# EasyEDA Pro project ProPrj_Syndra Version 2_2026-02-07.epro, schematic Schematic2
Board Name: DisplayBoard; Create Date: 2025-08-30; Page Name: P1; Project Name: Syndra3; Schematic Name: LED Matrix; Update Date: 2025-08-30; Company: torvid.net/syndra; Page Size: -; Version: V1.0
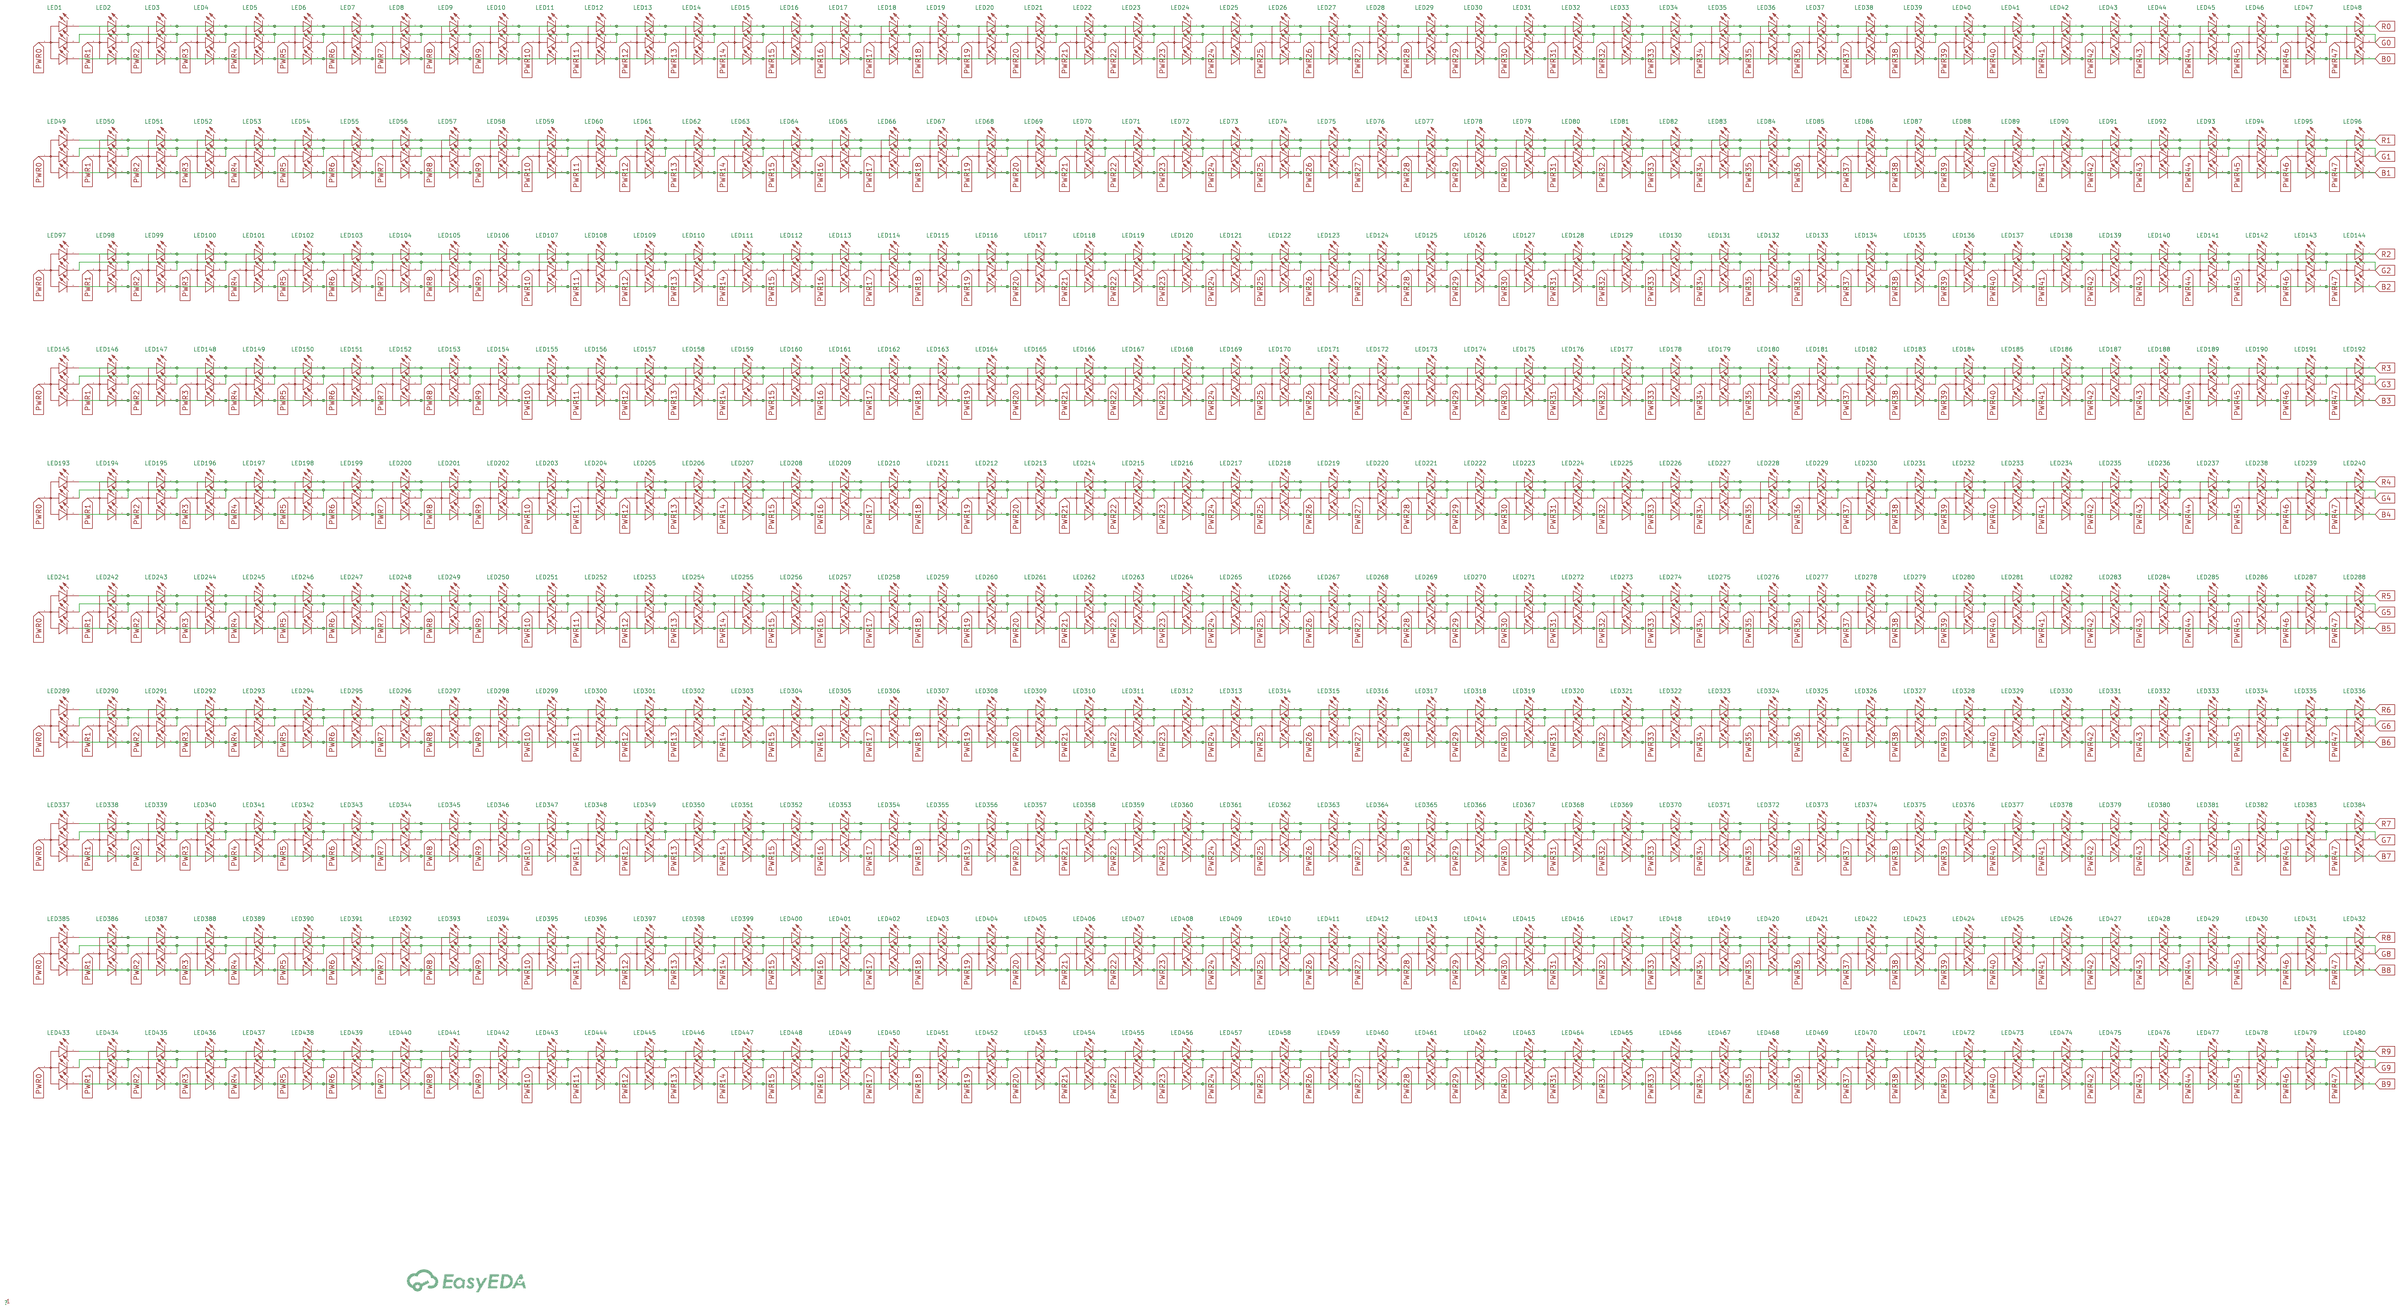
[diagram p0: schematic sheet]

## Parts
LED1  FC-B1010RGBT-HG  [LED-ARRAY-SMD_4P-L1.0-W1.0-TR-RD]
LED2  FC-B1010RGBT-HG  [LED-ARRAY-SMD_4P-L1.0-W1.0-TR-RD]
LED3  FC-B1010RGBT-HG  [LED-ARRAY-SMD_4P-L1.0-W1.0-TR-RD]
LED4  FC-B1010RGBT-HG  [LED-ARRAY-SMD_4P-L1.0-W1.0-TR-RD]
LED5  FC-B1010RGBT-HG  [LED-ARRAY-SMD_4P-L1.0-W1.0-TR-RD]
LED6  FC-B1010RGBT-HG  [LED-ARRAY-SMD_4P-L1.0-W1.0-TR-RD]
LED7  FC-B1010RGBT-HG  [LED-ARRAY-SMD_4P-L1.0-W1.0-TR-RD]
LED8  FC-B1010RGBT-HG  [LED-ARRAY-SMD_4P-L1.0-W1.0-TR-RD]
LED9  FC-B1010RGBT-HG  [LED-ARRAY-SMD_4P-L1.0-W1.0-TR-RD]
LED10  FC-B1010RGBT-HG  [LED-ARRAY-SMD_4P-L1.0-W1.0-TR-RD]
LED11  FC-B1010RGBT-HG  [LED-ARRAY-SMD_4P-L1.0-W1.0-TR-RD]
LED12  FC-B1010RGBT-HG  [LED-ARRAY-SMD_4P-L1.0-W1.0-TR-RD]
LED13  FC-B1010RGBT-HG  [LED-ARRAY-SMD_4P-L1.0-W1.0-TR-RD]
LED14  FC-B1010RGBT-HG  [LED-ARRAY-SMD_4P-L1.0-W1.0-TR-RD]
LED15  FC-B1010RGBT-HG  [LED-ARRAY-SMD_4P-L1.0-W1.0-TR-RD]
LED16  FC-B1010RGBT-HG  [LED-ARRAY-SMD_4P-L1.0-W1.0-TR-RD]
LED17  FC-B1010RGBT-HG  [LED-ARRAY-SMD_4P-L1.0-W1.0-TR-RD]
LED18  FC-B1010RGBT-HG  [LED-ARRAY-SMD_4P-L1.0-W1.0-TR-RD]
LED19  FC-B1010RGBT-HG  [LED-ARRAY-SMD_4P-L1.0-W1.0-TR-RD]
LED20  FC-B1010RGBT-HG  [LED-ARRAY-SMD_4P-L1.0-W1.0-TR-RD]
LED21  FC-B1010RGBT-HG  [LED-ARRAY-SMD_4P-L1.0-W1.0-TR-RD]
LED22  FC-B1010RGBT-HG  [LED-ARRAY-SMD_4P-L1.0-W1.0-TR-RD]
LED23  FC-B1010RGBT-HG  [LED-ARRAY-SMD_4P-L1.0-W1.0-TR-RD]
LED24  FC-B1010RGBT-HG  [LED-ARRAY-SMD_4P-L1.0-W1.0-TR-RD]
LED25  FC-B1010RGBT-HG  [LED-ARRAY-SMD_4P-L1.0-W1.0-TR-RD]
LED26  FC-B1010RGBT-HG  [LED-ARRAY-SMD_4P-L1.0-W1.0-TR-RD]
LED27  FC-B1010RGBT-HG  [LED-ARRAY-SMD_4P-L1.0-W1.0-TR-RD]
LED28  FC-B1010RGBT-HG  [LED-ARRAY-SMD_4P-L1.0-W1.0-TR-RD]
LED29  FC-B1010RGBT-HG  [LED-ARRAY-SMD_4P-L1.0-W1.0-TR-RD]
LED30  FC-B1010RGBT-HG  [LED-ARRAY-SMD_4P-L1.0-W1.0-TR-RD]
LED31  FC-B1010RGBT-HG  [LED-ARRAY-SMD_4P-L1.0-W1.0-TR-RD]
LED32  FC-B1010RGBT-HG  [LED-ARRAY-SMD_4P-L1.0-W1.0-TR-RD]
LED33  FC-B1010RGBT-HG  [LED-ARRAY-SMD_4P-L1.0-W1.0-TR-RD]
LED34  FC-B1010RGBT-HG  [LED-ARRAY-SMD_4P-L1.0-W1.0-TR-RD]
LED35  FC-B1010RGBT-HG  [LED-ARRAY-SMD_4P-L1.0-W1.0-TR-RD]
LED36  FC-B1010RGBT-HG  [LED-ARRAY-SMD_4P-L1.0-W1.0-TR-RD]
LED37  FC-B1010RGBT-HG  [LED-ARRAY-SMD_4P-L1.0-W1.0-TR-RD]
LED38  FC-B1010RGBT-HG  [LED-ARRAY-SMD_4P-L1.0-W1.0-TR-RD]
LED39  FC-B1010RGBT-HG  [LED-ARRAY-SMD_4P-L1.0-W1.0-TR-RD]
LED40  FC-B1010RGBT-HG  [LED-ARRAY-SMD_4P-L1.0-W1.0-TR-RD]
LED41  FC-B1010RGBT-HG  [LED-ARRAY-SMD_4P-L1.0-W1.0-TR-RD]
LED42  FC-B1010RGBT-HG  [LED-ARRAY-SMD_4P-L1.0-W1.0-TR-RD]
LED43  FC-B1010RGBT-HG  [LED-ARRAY-SMD_4P-L1.0-W1.0-TR-RD]
LED44  FC-B1010RGBT-HG  [LED-ARRAY-SMD_4P-L1.0-W1.0-TR-RD]
LED45  FC-B1010RGBT-HG  [LED-ARRAY-SMD_4P-L1.0-W1.0-TR-RD]
LED46  FC-B1010RGBT-HG  [LED-ARRAY-SMD_4P-L1.0-W1.0-TR-RD]
LED47  FC-B1010RGBT-HG  [LED-ARRAY-SMD_4P-L1.0-W1.0-TR-RD]
LED48  FC-B1010RGBT-HG  [LED-ARRAY-SMD_4P-L1.0-W1.0-TR-RD]
LED49  FC-B1010RGBT-HG  [LED-ARRAY-SMD_4P-L1.0-W1.0-TR-RD]
LED50  FC-B1010RGBT-HG  [LED-ARRAY-SMD_4P-L1.0-W1.0-TR-RD]
LED51  FC-B1010RGBT-HG  [LED-ARRAY-SMD_4P-L1.0-W1.0-TR-RD]
LED52  FC-B1010RGBT-HG  [LED-ARRAY-SMD_4P-L1.0-W1.0-TR-RD]
LED53  FC-B1010RGBT-HG  [LED-ARRAY-SMD_4P-L1.0-W1.0-TR-RD]
LED54  FC-B1010RGBT-HG  [LED-ARRAY-SMD_4P-L1.0-W1.0-TR-RD]
LED55  FC-B1010RGBT-HG  [LED-ARRAY-SMD_4P-L1.0-W1.0-TR-RD]
LED56  FC-B1010RGBT-HG  [LED-ARRAY-SMD_4P-L1.0-W1.0-TR-RD]
LED57  FC-B1010RGBT-HG  [LED-ARRAY-SMD_4P-L1.0-W1.0-TR-RD]
LED58  FC-B1010RGBT-HG  [LED-ARRAY-SMD_4P-L1.0-W1.0-TR-RD]
LED59  FC-B1010RGBT-HG  [LED-ARRAY-SMD_4P-L1.0-W1.0-TR-RD]
LED60  FC-B1010RGBT-HG  [LED-ARRAY-SMD_4P-L1.0-W1.0-TR-RD]
LED61  FC-B1010RGBT-HG  [LED-ARRAY-SMD_4P-L1.0-W1.0-TR-RD]
LED62  FC-B1010RGBT-HG  [LED-ARRAY-SMD_4P-L1.0-W1.0-TR-RD]
LED63  FC-B1010RGBT-HG  [LED-ARRAY-SMD_4P-L1.0-W1.0-TR-RD]
LED64  FC-B1010RGBT-HG  [LED-ARRAY-SMD_4P-L1.0-W1.0-TR-RD]
LED65  FC-B1010RGBT-HG  [LED-ARRAY-SMD_4P-L1.0-W1.0-TR-RD]
LED66  FC-B1010RGBT-HG  [LED-ARRAY-SMD_4P-L1.0-W1.0-TR-RD]
LED67  FC-B1010RGBT-HG  [LED-ARRAY-SMD_4P-L1.0-W1.0-TR-RD]
LED68  FC-B1010RGBT-HG  [LED-ARRAY-SMD_4P-L1.0-W1.0-TR-RD]
LED69  FC-B1010RGBT-HG  [LED-ARRAY-SMD_4P-L1.0-W1.0-TR-RD]
LED70  FC-B1010RGBT-HG  [LED-ARRAY-SMD_4P-L1.0-W1.0-TR-RD]
LED71  FC-B1010RGBT-HG  [LED-ARRAY-SMD_4P-L1.0-W1.0-TR-RD]
LED72  FC-B1010RGBT-HG  [LED-ARRAY-SMD_4P-L1.0-W1.0-TR-RD]
LED73  FC-B1010RGBT-HG  [LED-ARRAY-SMD_4P-L1.0-W1.0-TR-RD]
LED74  FC-B1010RGBT-HG  [LED-ARRAY-SMD_4P-L1.0-W1.0-TR-RD]
LED75  FC-B1010RGBT-HG  [LED-ARRAY-SMD_4P-L1.0-W1.0-TR-RD]
LED76  FC-B1010RGBT-HG  [LED-ARRAY-SMD_4P-L1.0-W1.0-TR-RD]
LED77  FC-B1010RGBT-HG  [LED-ARRAY-SMD_4P-L1.0-W1.0-TR-RD]
LED78  FC-B1010RGBT-HG  [LED-ARRAY-SMD_4P-L1.0-W1.0-TR-RD]
LED79  FC-B1010RGBT-HG  [LED-ARRAY-SMD_4P-L1.0-W1.0-TR-RD]
LED80  FC-B1010RGBT-HG  [LED-ARRAY-SMD_4P-L1.0-W1.0-TR-RD]
LED81  FC-B1010RGBT-HG  [LED-ARRAY-SMD_4P-L1.0-W1.0-TR-RD]
LED82  FC-B1010RGBT-HG  [LED-ARRAY-SMD_4P-L1.0-W1.0-TR-RD]
LED83  FC-B1010RGBT-HG  [LED-ARRAY-SMD_4P-L1.0-W1.0-TR-RD]
LED84  FC-B1010RGBT-HG  [LED-ARRAY-SMD_4P-L1.0-W1.0-TR-RD]
LED85  FC-B1010RGBT-HG  [LED-ARRAY-SMD_4P-L1.0-W1.0-TR-RD]
LED86  FC-B1010RGBT-HG  [LED-ARRAY-SMD_4P-L1.0-W1.0-TR-RD]
LED87  FC-B1010RGBT-HG  [LED-ARRAY-SMD_4P-L1.0-W1.0-TR-RD]
LED88  FC-B1010RGBT-HG  [LED-ARRAY-SMD_4P-L1.0-W1.0-TR-RD]
LED89  FC-B1010RGBT-HG  [LED-ARRAY-SMD_4P-L1.0-W1.0-TR-RD]
LED90  FC-B1010RGBT-HG  [LED-ARRAY-SMD_4P-L1.0-W1.0-TR-RD]
LED91  FC-B1010RGBT-HG  [LED-ARRAY-SMD_4P-L1.0-W1.0-TR-RD]
LED92  FC-B1010RGBT-HG  [LED-ARRAY-SMD_4P-L1.0-W1.0-TR-RD]
LED93  FC-B1010RGBT-HG  [LED-ARRAY-SMD_4P-L1.0-W1.0-TR-RD]
LED94  FC-B1010RGBT-HG  [LED-ARRAY-SMD_4P-L1.0-W1.0-TR-RD]
LED95  FC-B1010RGBT-HG  [LED-ARRAY-SMD_4P-L1.0-W1.0-TR-RD]
LED96  FC-B1010RGBT-HG  [LED-ARRAY-SMD_4P-L1.0-W1.0-TR-RD]
LED97  FC-B1010RGBT-HG  [LED-ARRAY-SMD_4P-L1.0-W1.0-TR-RD]
LED98  FC-B1010RGBT-HG  [LED-ARRAY-SMD_4P-L1.0-W1.0-TR-RD]
LED99  FC-B1010RGBT-HG  [LED-ARRAY-SMD_4P-L1.0-W1.0-TR-RD]
LED100  FC-B1010RGBT-HG  [LED-ARRAY-SMD_4P-L1.0-W1.0-TR-RD]
LED101  FC-B1010RGBT-HG  [LED-ARRAY-SMD_4P-L1.0-W1.0-TR-RD]
LED102  FC-B1010RGBT-HG  [LED-ARRAY-SMD_4P-L1.0-W1.0-TR-RD]
LED103  FC-B1010RGBT-HG  [LED-ARRAY-SMD_4P-L1.0-W1.0-TR-RD]
LED104  FC-B1010RGBT-HG  [LED-ARRAY-SMD_4P-L1.0-W1.0-TR-RD]
LED105  FC-B1010RGBT-HG  [LED-ARRAY-SMD_4P-L1.0-W1.0-TR-RD]
LED106  FC-B1010RGBT-HG  [LED-ARRAY-SMD_4P-L1.0-W1.0-TR-RD]
LED107  FC-B1010RGBT-HG  [LED-ARRAY-SMD_4P-L1.0-W1.0-TR-RD]
LED108  FC-B1010RGBT-HG  [LED-ARRAY-SMD_4P-L1.0-W1.0-TR-RD]
LED109  FC-B1010RGBT-HG  [LED-ARRAY-SMD_4P-L1.0-W1.0-TR-RD]
LED110  FC-B1010RGBT-HG  [LED-ARRAY-SMD_4P-L1.0-W1.0-TR-RD]
LED111  FC-B1010RGBT-HG  [LED-ARRAY-SMD_4P-L1.0-W1.0-TR-RD]
LED112  FC-B1010RGBT-HG  [LED-ARRAY-SMD_4P-L1.0-W1.0-TR-RD]
LED113  FC-B1010RGBT-HG  [LED-ARRAY-SMD_4P-L1.0-W1.0-TR-RD]
LED114  FC-B1010RGBT-HG  [LED-ARRAY-SMD_4P-L1.0-W1.0-TR-RD]
LED115  FC-B1010RGBT-HG  [LED-ARRAY-SMD_4P-L1.0-W1.0-TR-RD]
LED116  FC-B1010RGBT-HG  [LED-ARRAY-SMD_4P-L1.0-W1.0-TR-RD]
LED117  FC-B1010RGBT-HG  [LED-ARRAY-SMD_4P-L1.0-W1.0-TR-RD]
LED118  FC-B1010RGBT-HG  [LED-ARRAY-SMD_4P-L1.0-W1.0-TR-RD]
LED119  FC-B1010RGBT-HG  [LED-ARRAY-SMD_4P-L1.0-W1.0-TR-RD]
LED120  FC-B1010RGBT-HG  [LED-ARRAY-SMD_4P-L1.0-W1.0-TR-RD]
LED121  FC-B1010RGBT-HG  [LED-ARRAY-SMD_4P-L1.0-W1.0-TR-RD]
LED122  FC-B1010RGBT-HG  [LED-ARRAY-SMD_4P-L1.0-W1.0-TR-RD]
LED123  FC-B1010RGBT-HG  [LED-ARRAY-SMD_4P-L1.0-W1.0-TR-RD]
LED124  FC-B1010RGBT-HG  [LED-ARRAY-SMD_4P-L1.0-W1.0-TR-RD]
LED125  FC-B1010RGBT-HG  [LED-ARRAY-SMD_4P-L1.0-W1.0-TR-RD]
LED126  FC-B1010RGBT-HG  [LED-ARRAY-SMD_4P-L1.0-W1.0-TR-RD]
LED127  FC-B1010RGBT-HG  [LED-ARRAY-SMD_4P-L1.0-W1.0-TR-RD]
LED128  FC-B1010RGBT-HG  [LED-ARRAY-SMD_4P-L1.0-W1.0-TR-RD]
LED129  FC-B1010RGBT-HG  [LED-ARRAY-SMD_4P-L1.0-W1.0-TR-RD]
LED130  FC-B1010RGBT-HG  [LED-ARRAY-SMD_4P-L1.0-W1.0-TR-RD]
LED131  FC-B1010RGBT-HG  [LED-ARRAY-SMD_4P-L1.0-W1.0-TR-RD]
LED132  FC-B1010RGBT-HG  [LED-ARRAY-SMD_4P-L1.0-W1.0-TR-RD]
LED133  FC-B1010RGBT-HG  [LED-ARRAY-SMD_4P-L1.0-W1.0-TR-RD]
LED134  FC-B1010RGBT-HG  [LED-ARRAY-SMD_4P-L1.0-W1.0-TR-RD]
LED135  FC-B1010RGBT-HG  [LED-ARRAY-SMD_4P-L1.0-W1.0-TR-RD]
LED136  FC-B1010RGBT-HG  [LED-ARRAY-SMD_4P-L1.0-W1.0-TR-RD]
LED137  FC-B1010RGBT-HG  [LED-ARRAY-SMD_4P-L1.0-W1.0-TR-RD]
LED138  FC-B1010RGBT-HG  [LED-ARRAY-SMD_4P-L1.0-W1.0-TR-RD]
LED139  FC-B1010RGBT-HG  [LED-ARRAY-SMD_4P-L1.0-W1.0-TR-RD]
LED140  FC-B1010RGBT-HG  [LED-ARRAY-SMD_4P-L1.0-W1.0-TR-RD]
LED141  FC-B1010RGBT-HG  [LED-ARRAY-SMD_4P-L1.0-W1.0-TR-RD]
LED142  FC-B1010RGBT-HG  [LED-ARRAY-SMD_4P-L1.0-W1.0-TR-RD]
LED143  FC-B1010RGBT-HG  [LED-ARRAY-SMD_4P-L1.0-W1.0-TR-RD]
LED144  FC-B1010RGBT-HG  [LED-ARRAY-SMD_4P-L1.0-W1.0-TR-RD]
LED145  FC-B1010RGBT-HG  [LED-ARRAY-SMD_4P-L1.0-W1.0-TR-RD]
LED146  FC-B1010RGBT-HG  [LED-ARRAY-SMD_4P-L1.0-W1.0-TR-RD]
LED147  FC-B1010RGBT-HG  [LED-ARRAY-SMD_4P-L1.0-W1.0-TR-RD]
LED148  FC-B1010RGBT-HG  [LED-ARRAY-SMD_4P-L1.0-W1.0-TR-RD]
LED149  FC-B1010RGBT-HG  [LED-ARRAY-SMD_4P-L1.0-W1.0-TR-RD]
LED150  FC-B1010RGBT-HG  [LED-ARRAY-SMD_4P-L1.0-W1.0-TR-RD]
LED151  FC-B1010RGBT-HG  [LED-ARRAY-SMD_4P-L1.0-W1.0-TR-RD]
LED152  FC-B1010RGBT-HG  [LED-ARRAY-SMD_4P-L1.0-W1.0-TR-RD]
LED153  FC-B1010RGBT-HG  [LED-ARRAY-SMD_4P-L1.0-W1.0-TR-RD]
LED154  FC-B1010RGBT-HG  [LED-ARRAY-SMD_4P-L1.0-W1.0-TR-RD]
LED155  FC-B1010RGBT-HG  [LED-ARRAY-SMD_4P-L1.0-W1.0-TR-RD]
LED156  FC-B1010RGBT-HG  [LED-ARRAY-SMD_4P-L1.0-W1.0-TR-RD]
LED157  FC-B1010RGBT-HG  [LED-ARRAY-SMD_4P-L1.0-W1.0-TR-RD]
LED158  FC-B1010RGBT-HG  [LED-ARRAY-SMD_4P-L1.0-W1.0-TR-RD]
LED159  FC-B1010RGBT-HG  [LED-ARRAY-SMD_4P-L1.0-W1.0-TR-RD]
LED160  FC-B1010RGBT-HG  [LED-ARRAY-SMD_4P-L1.0-W1.0-TR-RD]
LED161  FC-B1010RGBT-HG  [LED-ARRAY-SMD_4P-L1.0-W1.0-TR-RD]
LED162  FC-B1010RGBT-HG  [LED-ARRAY-SMD_4P-L1.0-W1.0-TR-RD]
LED163  FC-B1010RGBT-HG  [LED-ARRAY-SMD_4P-L1.0-W1.0-TR-RD]
LED164  FC-B1010RGBT-HG  [LED-ARRAY-SMD_4P-L1.0-W1.0-TR-RD]
LED165  FC-B1010RGBT-HG  [LED-ARRAY-SMD_4P-L1.0-W1.0-TR-RD]
LED166  FC-B1010RGBT-HG  [LED-ARRAY-SMD_4P-L1.0-W1.0-TR-RD]
LED167  FC-B1010RGBT-HG  [LED-ARRAY-SMD_4P-L1.0-W1.0-TR-RD]
LED168  FC-B1010RGBT-HG  [LED-ARRAY-SMD_4P-L1.0-W1.0-TR-RD]
LED169  FC-B1010RGBT-HG  [LED-ARRAY-SMD_4P-L1.0-W1.0-TR-RD]
LED170  FC-B1010RGBT-HG  [LED-ARRAY-SMD_4P-L1.0-W1.0-TR-RD]
LED171  FC-B1010RGBT-HG  [LED-ARRAY-SMD_4P-L1.0-W1.0-TR-RD]
LED172  FC-B1010RGBT-HG  [LED-ARRAY-SMD_4P-L1.0-W1.0-TR-RD]
LED173  FC-B1010RGBT-HG  [LED-ARRAY-SMD_4P-L1.0-W1.0-TR-RD]
LED174  FC-B1010RGBT-HG  [LED-ARRAY-SMD_4P-L1.0-W1.0-TR-RD]
LED175  FC-B1010RGBT-HG  [LED-ARRAY-SMD_4P-L1.0-W1.0-TR-RD]
LED176  FC-B1010RGBT-HG  [LED-ARRAY-SMD_4P-L1.0-W1.0-TR-RD]
LED177  FC-B1010RGBT-HG  [LED-ARRAY-SMD_4P-L1.0-W1.0-TR-RD]
LED178  FC-B1010RGBT-HG  [LED-ARRAY-SMD_4P-L1.0-W1.0-TR-RD]
LED179  FC-B1010RGBT-HG  [LED-ARRAY-SMD_4P-L1.0-W1.0-TR-RD]
LED180  FC-B1010RGBT-HG  [LED-ARRAY-SMD_4P-L1.0-W1.0-TR-RD]
LED181  FC-B1010RGBT-HG  [LED-ARRAY-SMD_4P-L1.0-W1.0-TR-RD]
LED182  FC-B1010RGBT-HG  [LED-ARRAY-SMD_4P-L1.0-W1.0-TR-RD]
LED183  FC-B1010RGBT-HG  [LED-ARRAY-SMD_4P-L1.0-W1.0-TR-RD]
LED184  FC-B1010RGBT-HG  [LED-ARRAY-SMD_4P-L1.0-W1.0-TR-RD]
LED185  FC-B1010RGBT-HG  [LED-ARRAY-SMD_4P-L1.0-W1.0-TR-RD]
LED186  FC-B1010RGBT-HG  [LED-ARRAY-SMD_4P-L1.0-W1.0-TR-RD]
LED187  FC-B1010RGBT-HG  [LED-ARRAY-SMD_4P-L1.0-W1.0-TR-RD]
LED188  FC-B1010RGBT-HG  [LED-ARRAY-SMD_4P-L1.0-W1.0-TR-RD]
LED189  FC-B1010RGBT-HG  [LED-ARRAY-SMD_4P-L1.0-W1.0-TR-RD]
LED190  FC-B1010RGBT-HG  [LED-ARRAY-SMD_4P-L1.0-W1.0-TR-RD]
LED191  FC-B1010RGBT-HG  [LED-ARRAY-SMD_4P-L1.0-W1.0-TR-RD]
LED192  FC-B1010RGBT-HG  [LED-ARRAY-SMD_4P-L1.0-W1.0-TR-RD]
LED193  FC-B1010RGBT-HG  [LED-ARRAY-SMD_4P-L1.0-W1.0-TR-RD]
LED194  FC-B1010RGBT-HG  [LED-ARRAY-SMD_4P-L1.0-W1.0-TR-RD]
LED195  FC-B1010RGBT-HG  [LED-ARRAY-SMD_4P-L1.0-W1.0-TR-RD]
LED196  FC-B1010RGBT-HG  [LED-ARRAY-SMD_4P-L1.0-W1.0-TR-RD]
LED197  FC-B1010RGBT-HG  [LED-ARRAY-SMD_4P-L1.0-W1.0-TR-RD]
LED198  FC-B1010RGBT-HG  [LED-ARRAY-SMD_4P-L1.0-W1.0-TR-RD]
LED199  FC-B1010RGBT-HG  [LED-ARRAY-SMD_4P-L1.0-W1.0-TR-RD]
LED200  FC-B1010RGBT-HG  [LED-ARRAY-SMD_4P-L1.0-W1.0-TR-RD]
LED201  FC-B1010RGBT-HG  [LED-ARRAY-SMD_4P-L1.0-W1.0-TR-RD]
LED202  FC-B1010RGBT-HG  [LED-ARRAY-SMD_4P-L1.0-W1.0-TR-RD]
LED203  FC-B1010RGBT-HG  [LED-ARRAY-SMD_4P-L1.0-W1.0-TR-RD]
LED204  FC-B1010RGBT-HG  [LED-ARRAY-SMD_4P-L1.0-W1.0-TR-RD]
LED205  FC-B1010RGBT-HG  [LED-ARRAY-SMD_4P-L1.0-W1.0-TR-RD]
LED206  FC-B1010RGBT-HG  [LED-ARRAY-SMD_4P-L1.0-W1.0-TR-RD]
LED207  FC-B1010RGBT-HG  [LED-ARRAY-SMD_4P-L1.0-W1.0-TR-RD]
LED208  FC-B1010RGBT-HG  [LED-ARRAY-SMD_4P-L1.0-W1.0-TR-RD]
LED209  FC-B1010RGBT-HG  [LED-ARRAY-SMD_4P-L1.0-W1.0-TR-RD]
LED210  FC-B1010RGBT-HG  [LED-ARRAY-SMD_4P-L1.0-W1.0-TR-RD]
LED211  FC-B1010RGBT-HG  [LED-ARRAY-SMD_4P-L1.0-W1.0-TR-RD]
LED212  FC-B1010RGBT-HG  [LED-ARRAY-SMD_4P-L1.0-W1.0-TR-RD]
LED213  FC-B1010RGBT-HG  [LED-ARRAY-SMD_4P-L1.0-W1.0-TR-RD]
LED214  FC-B1010RGBT-HG  [LED-ARRAY-SMD_4P-L1.0-W1.0-TR-RD]
LED215  FC-B1010RGBT-HG  [LED-ARRAY-SMD_4P-L1.0-W1.0-TR-RD]
LED216  FC-B1010RGBT-HG  [LED-ARRAY-SMD_4P-L1.0-W1.0-TR-RD]
LED217  FC-B1010RGBT-HG  [LED-ARRAY-SMD_4P-L1.0-W1.0-TR-RD]
LED218  FC-B1010RGBT-HG  [LED-ARRAY-SMD_4P-L1.0-W1.0-TR-RD]
LED219  FC-B1010RGBT-HG  [LED-ARRAY-SMD_4P-L1.0-W1.0-TR-RD]
LED220  FC-B1010RGBT-HG  [LED-ARRAY-SMD_4P-L1.0-W1.0-TR-RD]
LED221  FC-B1010RGBT-HG  [LED-ARRAY-SMD_4P-L1.0-W1.0-TR-RD]
LED222  FC-B1010RGBT-HG  [LED-ARRAY-SMD_4P-L1.0-W1.0-TR-RD]
LED223  FC-B1010RGBT-HG  [LED-ARRAY-SMD_4P-L1.0-W1.0-TR-RD]
LED224  FC-B1010RGBT-HG  [LED-ARRAY-SMD_4P-L1.0-W1.0-TR-RD]
LED225  FC-B1010RGBT-HG  [LED-ARRAY-SMD_4P-L1.0-W1.0-TR-RD]
LED226  FC-B1010RGBT-HG  [LED-ARRAY-SMD_4P-L1.0-W1.0-TR-RD]
LED227  FC-B1010RGBT-HG  [LED-ARRAY-SMD_4P-L1.0-W1.0-TR-RD]
LED228  FC-B1010RGBT-HG  [LED-ARRAY-SMD_4P-L1.0-W1.0-TR-RD]
LED229  FC-B1010RGBT-HG  [LED-ARRAY-SMD_4P-L1.0-W1.0-TR-RD]
LED230  FC-B1010RGBT-HG  [LED-ARRAY-SMD_4P-L1.0-W1.0-TR-RD]
LED231  FC-B1010RGBT-HG  [LED-ARRAY-SMD_4P-L1.0-W1.0-TR-RD]
LED232  FC-B1010RGBT-HG  [LED-ARRAY-SMD_4P-L1.0-W1.0-TR-RD]
LED233  FC-B1010RGBT-HG  [LED-ARRAY-SMD_4P-L1.0-W1.0-TR-RD]
LED234  FC-B1010RGBT-HG  [LED-ARRAY-SMD_4P-L1.0-W1.0-TR-RD]
LED235  FC-B1010RGBT-HG  [LED-ARRAY-SMD_4P-L1.0-W1.0-TR-RD]
LED236  FC-B1010RGBT-HG  [LED-ARRAY-SMD_4P-L1.0-W1.0-TR-RD]
LED237  FC-B1010RGBT-HG  [LED-ARRAY-SMD_4P-L1.0-W1.0-TR-RD]
LED238  FC-B1010RGBT-HG  [LED-ARRAY-SMD_4P-L1.0-W1.0-TR-RD]
LED239  FC-B1010RGBT-HG  [LED-ARRAY-SMD_4P-L1.0-W1.0-TR-RD]
LED240  FC-B1010RGBT-HG  [LED-ARRAY-SMD_4P-L1.0-W1.0-TR-RD]
LED241  FC-B1010RGBT-HG  [LED-ARRAY-SMD_4P-L1.0-W1.0-TR-RD]
LED242  FC-B1010RGBT-HG  [LED-ARRAY-SMD_4P-L1.0-W1.0-TR-RD]
LED243  FC-B1010RGBT-HG  [LED-ARRAY-SMD_4P-L1.0-W1.0-TR-RD]
LED244  FC-B1010RGBT-HG  [LED-ARRAY-SMD_4P-L1.0-W1.0-TR-RD]
LED245  FC-B1010RGBT-HG  [LED-ARRAY-SMD_4P-L1.0-W1.0-TR-RD]
LED246  FC-B1010RGBT-HG  [LED-ARRAY-SMD_4P-L1.0-W1.0-TR-RD]
LED247  FC-B1010RGBT-HG  [LED-ARRAY-SMD_4P-L1.0-W1.0-TR-RD]
LED248  FC-B1010RGBT-HG  [LED-ARRAY-SMD_4P-L1.0-W1.0-TR-RD]
LED249  FC-B1010RGBT-HG  [LED-ARRAY-SMD_4P-L1.0-W1.0-TR-RD]
LED250  FC-B1010RGBT-HG  [LED-ARRAY-SMD_4P-L1.0-W1.0-TR-RD]
LED251  FC-B1010RGBT-HG  [LED-ARRAY-SMD_4P-L1.0-W1.0-TR-RD]
LED252  FC-B1010RGBT-HG  [LED-ARRAY-SMD_4P-L1.0-W1.0-TR-RD]
LED253  FC-B1010RGBT-HG  [LED-ARRAY-SMD_4P-L1.0-W1.0-TR-RD]
LED254  FC-B1010RGBT-HG  [LED-ARRAY-SMD_4P-L1.0-W1.0-TR-RD]
LED255  FC-B1010RGBT-HG  [LED-ARRAY-SMD_4P-L1.0-W1.0-TR-RD]
LED256  FC-B1010RGBT-HG  [LED-ARRAY-SMD_4P-L1.0-W1.0-TR-RD]
LED257  FC-B1010RGBT-HG  [LED-ARRAY-SMD_4P-L1.0-W1.0-TR-RD]
LED258  FC-B1010RGBT-HG  [LED-ARRAY-SMD_4P-L1.0-W1.0-TR-RD]
LED259  FC-B1010RGBT-HG  [LED-ARRAY-SMD_4P-L1.0-W1.0-TR-RD]
LED260  FC-B1010RGBT-HG  [LED-ARRAY-SMD_4P-L1.0-W1.0-TR-RD]
LED261  FC-B1010RGBT-HG  [LED-ARRAY-SMD_4P-L1.0-W1.0-TR-RD]
LED262  FC-B1010RGBT-HG  [LED-ARRAY-SMD_4P-L1.0-W1.0-TR-RD]
LED263  FC-B1010RGBT-HG  [LED-ARRAY-SMD_4P-L1.0-W1.0-TR-RD]
LED264  FC-B1010RGBT-HG  [LED-ARRAY-SMD_4P-L1.0-W1.0-TR-RD]
LED265  FC-B1010RGBT-HG  [LED-ARRAY-SMD_4P-L1.0-W1.0-TR-RD]
LED266  FC-B1010RGBT-HG  [LED-ARRAY-SMD_4P-L1.0-W1.0-TR-RD]
LED267  FC-B1010RGBT-HG  [LED-ARRAY-SMD_4P-L1.0-W1.0-TR-RD]
LED268  FC-B1010RGBT-HG  [LED-ARRAY-SMD_4P-L1.0-W1.0-TR-RD]
LED269  FC-B1010RGBT-HG  [LED-ARRAY-SMD_4P-L1.0-W1.0-TR-RD]
LED270  FC-B1010RGBT-HG  [LED-ARRAY-SMD_4P-L1.0-W1.0-TR-RD]
LED271  FC-B1010RGBT-HG  [LED-ARRAY-SMD_4P-L1.0-W1.0-TR-RD]
LED272  FC-B1010RGBT-HG  [LED-ARRAY-SMD_4P-L1.0-W1.0-TR-RD]
LED273  FC-B1010RGBT-HG  [LED-ARRAY-SMD_4P-L1.0-W1.0-TR-RD]
LED274  FC-B1010RGBT-HG  [LED-ARRAY-SMD_4P-L1.0-W1.0-TR-RD]
LED275  FC-B1010RGBT-HG  [LED-ARRAY-SMD_4P-L1.0-W1.0-TR-RD]
LED276  FC-B1010RGBT-HG  [LED-ARRAY-SMD_4P-L1.0-W1.0-TR-RD]
LED277  FC-B1010RGBT-HG  [LED-ARRAY-SMD_4P-L1.0-W1.0-TR-RD]
LED278  FC-B1010RGBT-HG  [LED-ARRAY-SMD_4P-L1.0-W1.0-TR-RD]
LED279  FC-B1010RGBT-HG  [LED-ARRAY-SMD_4P-L1.0-W1.0-TR-RD]
LED280  FC-B1010RGBT-HG  [LED-ARRAY-SMD_4P-L1.0-W1.0-TR-RD]
LED281  FC-B1010RGBT-HG  [LED-ARRAY-SMD_4P-L1.0-W1.0-TR-RD]
LED282  FC-B1010RGBT-HG  [LED-ARRAY-SMD_4P-L1.0-W1.0-TR-RD]
LED283  FC-B1010RGBT-HG  [LED-ARRAY-SMD_4P-L1.0-W1.0-TR-RD]
LED284  FC-B1010RGBT-HG  [LED-ARRAY-SMD_4P-L1.0-W1.0-TR-RD]
LED285  FC-B1010RGBT-HG  [LED-ARRAY-SMD_4P-L1.0-W1.0-TR-RD]
LED286  FC-B1010RGBT-HG  [LED-ARRAY-SMD_4P-L1.0-W1.0-TR-RD]
LED287  FC-B1010RGBT-HG  [LED-ARRAY-SMD_4P-L1.0-W1.0-TR-RD]
LED288  FC-B1010RGBT-HG  [LED-ARRAY-SMD_4P-L1.0-W1.0-TR-RD]
LED289  FC-B1010RGBT-HG  [LED-ARRAY-SMD_4P-L1.0-W1.0-TR-RD]
LED290  FC-B1010RGBT-HG  [LED-ARRAY-SMD_4P-L1.0-W1.0-TR-RD]
LED291  FC-B1010RGBT-HG  [LED-ARRAY-SMD_4P-L1.0-W1.0-TR-RD]
LED292  FC-B1010RGBT-HG  [LED-ARRAY-SMD_4P-L1.0-W1.0-TR-RD]
LED293  FC-B1010RGBT-HG  [LED-ARRAY-SMD_4P-L1.0-W1.0-TR-RD]
LED294  FC-B1010RGBT-HG  [LED-ARRAY-SMD_4P-L1.0-W1.0-TR-RD]
LED295  FC-B1010RGBT-HG  [LED-ARRAY-SMD_4P-L1.0-W1.0-TR-RD]
LED296  FC-B1010RGBT-HG  [LED-ARRAY-SMD_4P-L1.0-W1.0-TR-RD]
LED297  FC-B1010RGBT-HG  [LED-ARRAY-SMD_4P-L1.0-W1.0-TR-RD]
LED298  FC-B1010RGBT-HG  [LED-ARRAY-SMD_4P-L1.0-W1.0-TR-RD]
LED299  FC-B1010RGBT-HG  [LED-ARRAY-SMD_4P-L1.0-W1.0-TR-RD]
LED300  FC-B1010RGBT-HG  [LED-ARRAY-SMD_4P-L1.0-W1.0-TR-RD]
LED301  FC-B1010RGBT-HG  [LED-ARRAY-SMD_4P-L1.0-W1.0-TR-RD]
LED302  FC-B1010RGBT-HG  [LED-ARRAY-SMD_4P-L1.0-W1.0-TR-RD]
LED303  FC-B1010RGBT-HG  [LED-ARRAY-SMD_4P-L1.0-W1.0-TR-RD]
LED304  FC-B1010RGBT-HG  [LED-ARRAY-SMD_4P-L1.0-W1.0-TR-RD]
LED305  FC-B1010RGBT-HG  [LED-ARRAY-SMD_4P-L1.0-W1.0-TR-RD]
LED306  FC-B1010RGBT-HG  [LED-ARRAY-SMD_4P-L1.0-W1.0-TR-RD]
LED307  FC-B1010RGBT-HG  [LED-ARRAY-SMD_4P-L1.0-W1.0-TR-RD]
LED308  FC-B1010RGBT-HG  [LED-ARRAY-SMD_4P-L1.0-W1.0-TR-RD]
LED309  FC-B1010RGBT-HG  [LED-ARRAY-SMD_4P-L1.0-W1.0-TR-RD]
LED310  FC-B1010RGBT-HG  [LED-ARRAY-SMD_4P-L1.0-W1.0-TR-RD]
LED311  FC-B1010RGBT-HG  [LED-ARRAY-SMD_4P-L1.0-W1.0-TR-RD]
LED312  FC-B1010RGBT-HG  [LED-ARRAY-SMD_4P-L1.0-W1.0-TR-RD]
LED313  FC-B1010RGBT-HG  [LED-ARRAY-SMD_4P-L1.0-W1.0-TR-RD]
LED314  FC-B1010RGBT-HG  [LED-ARRAY-SMD_4P-L1.0-W1.0-TR-RD]
LED315  FC-B1010RGBT-HG  [LED-ARRAY-SMD_4P-L1.0-W1.0-TR-RD]
LED316  FC-B1010RGBT-HG  [LED-ARRAY-SMD_4P-L1.0-W1.0-TR-RD]
LED317  FC-B1010RGBT-HG  [LED-ARRAY-SMD_4P-L1.0-W1.0-TR-RD]
LED318  FC-B1010RGBT-HG  [LED-ARRAY-SMD_4P-L1.0-W1.0-TR-RD]
LED319  FC-B1010RGBT-HG  [LED-ARRAY-SMD_4P-L1.0-W1.0-TR-RD]
LED320  FC-B1010RGBT-HG  [LED-ARRAY-SMD_4P-L1.0-W1.0-TR-RD]
LED321  FC-B1010RGBT-HG  [LED-ARRAY-SMD_4P-L1.0-W1.0-TR-RD]
LED322  FC-B1010RGBT-HG  [LED-ARRAY-SMD_4P-L1.0-W1.0-TR-RD]
LED323  FC-B1010RGBT-HG  [LED-ARRAY-SMD_4P-L1.0-W1.0-TR-RD]
LED324  FC-B1010RGBT-HG  [LED-ARRAY-SMD_4P-L1.0-W1.0-TR-RD]
LED325  FC-B1010RGBT-HG  [LED-ARRAY-SMD_4P-L1.0-W1.0-TR-RD]
LED326  FC-B1010RGBT-HG  [LED-ARRAY-SMD_4P-L1.0-W1.0-TR-RD]
LED327  FC-B1010RGBT-HG  [LED-ARRAY-SMD_4P-L1.0-W1.0-TR-RD]
LED328  FC-B1010RGBT-HG  [LED-ARRAY-SMD_4P-L1.0-W1.0-TR-RD]
LED329  FC-B1010RGBT-HG  [LED-ARRAY-SMD_4P-L1.0-W1.0-TR-RD]
LED330  FC-B1010RGBT-HG  [LED-ARRAY-SMD_4P-L1.0-W1.0-TR-RD]
LED331  FC-B1010RGBT-HG  [LED-ARRAY-SMD_4P-L1.0-W1.0-TR-RD]
LED332  FC-B1010RGBT-HG  [LED-ARRAY-SMD_4P-L1.0-W1.0-TR-RD]
LED333  FC-B1010RGBT-HG  [LED-ARRAY-SMD_4P-L1.0-W1.0-TR-RD]
LED334  FC-B1010RGBT-HG  [LED-ARRAY-SMD_4P-L1.0-W1.0-TR-RD]
LED335  FC-B1010RGBT-HG  [LED-ARRAY-SMD_4P-L1.0-W1.0-TR-RD]
LED336  FC-B1010RGBT-HG  [LED-ARRAY-SMD_4P-L1.0-W1.0-TR-RD]
LED337  FC-B1010RGBT-HG  [LED-ARRAY-SMD_4P-L1.0-W1.0-TR-RD]
LED338  FC-B1010RGBT-HG  [LED-ARRAY-SMD_4P-L1.0-W1.0-TR-RD]
LED339  FC-B1010RGBT-HG  [LED-ARRAY-SMD_4P-L1.0-W1.0-TR-RD]
LED340  FC-B1010RGBT-HG  [LED-ARRAY-SMD_4P-L1.0-W1.0-TR-RD]
LED341  FC-B1010RGBT-HG  [LED-ARRAY-SMD_4P-L1.0-W1.0-TR-RD]
LED342  FC-B1010RGBT-HG  [LED-ARRAY-SMD_4P-L1.0-W1.0-TR-RD]
LED343  FC-B1010RGBT-HG  [LED-ARRAY-SMD_4P-L1.0-W1.0-TR-RD]
LED344  FC-B1010RGBT-HG  [LED-ARRAY-SMD_4P-L1.0-W1.0-TR-RD]
LED345  FC-B1010RGBT-HG  [LED-ARRAY-SMD_4P-L1.0-W1.0-TR-RD]
LED346  FC-B1010RGBT-HG  [LED-ARRAY-SMD_4P-L1.0-W1.0-TR-RD]
LED347  FC-B1010RGBT-HG  [LED-ARRAY-SMD_4P-L1.0-W1.0-TR-RD]
LED348  FC-B1010RGBT-HG  [LED-ARRAY-SMD_4P-L1.0-W1.0-TR-RD]
LED349  FC-B1010RGBT-HG  [LED-ARRAY-SMD_4P-L1.0-W1.0-TR-RD]
LED350  FC-B1010RGBT-HG  [LED-ARRAY-SMD_4P-L1.0-W1.0-TR-RD]
LED351  FC-B1010RGBT-HG  [LED-ARRAY-SMD_4P-L1.0-W1.0-TR-RD]
LED352  FC-B1010RGBT-HG  [LED-ARRAY-SMD_4P-L1.0-W1.0-TR-RD]
LED353  FC-B1010RGBT-HG  [LED-ARRAY-SMD_4P-L1.0-W1.0-TR-RD]
LED354  FC-B1010RGBT-HG  [LED-ARRAY-SMD_4P-L1.0-W1.0-TR-RD]
LED355  FC-B1010RGBT-HG  [LED-ARRAY-SMD_4P-L1.0-W1.0-TR-RD]
LED356  FC-B1010RGBT-HG  [LED-ARRAY-SMD_4P-L1.0-W1.0-TR-RD]
LED357  FC-B1010RGBT-HG  [LED-ARRAY-SMD_4P-L1.0-W1.0-TR-RD]
LED358  FC-B1010RGBT-HG  [LED-ARRAY-SMD_4P-L1.0-W1.0-TR-RD]
LED359  FC-B1010RGBT-HG  [LED-ARRAY-SMD_4P-L1.0-W1.0-TR-RD]
LED360  FC-B1010RGBT-HG  [LED-ARRAY-SMD_4P-L1.0-W1.0-TR-RD]
LED361  FC-B1010RGBT-HG  [LED-ARRAY-SMD_4P-L1.0-W1.0-TR-RD]
LED362  FC-B1010RGBT-HG  [LED-ARRAY-SMD_4P-L1.0-W1.0-TR-RD]
LED363  FC-B1010RGBT-HG  [LED-ARRAY-SMD_4P-L1.0-W1.0-TR-RD]
LED364  FC-B1010RGBT-HG  [LED-ARRAY-SMD_4P-L1.0-W1.0-TR-RD]
LED365  FC-B1010RGBT-HG  [LED-ARRAY-SMD_4P-L1.0-W1.0-TR-RD]
LED366  FC-B1010RGBT-HG  [LED-ARRAY-SMD_4P-L1.0-W1.0-TR-RD]
LED367  FC-B1010RGBT-HG  [LED-ARRAY-SMD_4P-L1.0-W1.0-TR-RD]
LED368  FC-B1010RGBT-HG  [LED-ARRAY-SMD_4P-L1.0-W1.0-TR-RD]
LED369  FC-B1010RGBT-HG  [LED-ARRAY-SMD_4P-L1.0-W1.0-TR-RD]
LED370  FC-B1010RGBT-HG  [LED-ARRAY-SMD_4P-L1.0-W1.0-TR-RD]
LED371  FC-B1010RGBT-HG  [LED-ARRAY-SMD_4P-L1.0-W1.0-TR-RD]
LED372  FC-B1010RGBT-HG  [LED-ARRAY-SMD_4P-L1.0-W1.0-TR-RD]
LED373  FC-B1010RGBT-HG  [LED-ARRAY-SMD_4P-L1.0-W1.0-TR-RD]
LED374  FC-B1010RGBT-HG  [LED-ARRAY-SMD_4P-L1.0-W1.0-TR-RD]
LED375  FC-B1010RGBT-HG  [LED-ARRAY-SMD_4P-L1.0-W1.0-TR-RD]
LED376  FC-B1010RGBT-HG  [LED-ARRAY-SMD_4P-L1.0-W1.0-TR-RD]
LED377  FC-B1010RGBT-HG  [LED-ARRAY-SMD_4P-L1.0-W1.0-TR-RD]
LED378  FC-B1010RGBT-HG  [LED-ARRAY-SMD_4P-L1.0-W1.0-TR-RD]
LED379  FC-B1010RGBT-HG  [LED-ARRAY-SMD_4P-L1.0-W1.0-TR-RD]
LED380  FC-B1010RGBT-HG  [LED-ARRAY-SMD_4P-L1.0-W1.0-TR-RD]
LED381  FC-B1010RGBT-HG  [LED-ARRAY-SMD_4P-L1.0-W1.0-TR-RD]
LED382  FC-B1010RGBT-HG  [LED-ARRAY-SMD_4P-L1.0-W1.0-TR-RD]
LED383  FC-B1010RGBT-HG  [LED-ARRAY-SMD_4P-L1.0-W1.0-TR-RD]
LED384  FC-B1010RGBT-HG  [LED-ARRAY-SMD_4P-L1.0-W1.0-TR-RD]
LED385  FC-B1010RGBT-HG  [LED-ARRAY-SMD_4P-L1.0-W1.0-TR-RD]
LED386  FC-B1010RGBT-HG  [LED-ARRAY-SMD_4P-L1.0-W1.0-TR-RD]
LED387  FC-B1010RGBT-HG  [LED-ARRAY-SMD_4P-L1.0-W1.0-TR-RD]
LED388  FC-B1010RGBT-HG  [LED-ARRAY-SMD_4P-L1.0-W1.0-TR-RD]
LED389  FC-B1010RGBT-HG  [LED-ARRAY-SMD_4P-L1.0-W1.0-TR-RD]
LED390  FC-B1010RGBT-HG  [LED-ARRAY-SMD_4P-L1.0-W1.0-TR-RD]
LED391  FC-B1010RGBT-HG  [LED-ARRAY-SMD_4P-L1.0-W1.0-TR-RD]
LED392  FC-B1010RGBT-HG  [LED-ARRAY-SMD_4P-L1.0-W1.0-TR-RD]
LED393  FC-B1010RGBT-HG  [LED-ARRAY-SMD_4P-L1.0-W1.0-TR-RD]
LED394  FC-B1010RGBT-HG  [LED-ARRAY-SMD_4P-L1.0-W1.0-TR-RD]
LED395  FC-B1010RGBT-HG  [LED-ARRAY-SMD_4P-L1.0-W1.0-TR-RD]
LED396  FC-B1010RGBT-HG  [LED-ARRAY-SMD_4P-L1.0-W1.0-TR-RD]
LED397  FC-B1010RGBT-HG  [LED-ARRAY-SMD_4P-L1.0-W1.0-TR-RD]
LED398  FC-B1010RGBT-HG  [LED-ARRAY-SMD_4P-L1.0-W1.0-TR-RD]
LED399  FC-B1010RGBT-HG  [LED-ARRAY-SMD_4P-L1.0-W1.0-TR-RD]
LED400  FC-B1010RGBT-HG  [LED-ARRAY-SMD_4P-L1.0-W1.0-TR-RD]
LED401  FC-B1010RGBT-HG  [LED-ARRAY-SMD_4P-L1.0-W1.0-TR-RD]
LED402  FC-B1010RGBT-HG  [LED-ARRAY-SMD_4P-L1.0-W1.0-TR-RD]
LED403  FC-B1010RGBT-HG  [LED-ARRAY-SMD_4P-L1.0-W1.0-TR-RD]
LED404  FC-B1010RGBT-HG  [LED-ARRAY-SMD_4P-L1.0-W1.0-TR-RD]
LED405  FC-B1010RGBT-HG  [LED-ARRAY-SMD_4P-L1.0-W1.0-TR-RD]
LED406  FC-B1010RGBT-HG  [LED-ARRAY-SMD_4P-L1.0-W1.0-TR-RD]
LED407  FC-B1010RGBT-HG  [LED-ARRAY-SMD_4P-L1.0-W1.0-TR-RD]
LED408  FC-B1010RGBT-HG  [LED-ARRAY-SMD_4P-L1.0-W1.0-TR-RD]
LED409  FC-B1010RGBT-HG  [LED-ARRAY-SMD_4P-L1.0-W1.0-TR-RD]
LED410  FC-B1010RGBT-HG  [LED-ARRAY-SMD_4P-L1.0-W1.0-TR-RD]
LED411  FC-B1010RGBT-HG  [LED-ARRAY-SMD_4P-L1.0-W1.0-TR-RD]
LED412  FC-B1010RGBT-HG  [LED-ARRAY-SMD_4P-L1.0-W1.0-TR-RD]
LED413  FC-B1010RGBT-HG  [LED-ARRAY-SMD_4P-L1.0-W1.0-TR-RD]
LED414  FC-B1010RGBT-HG  [LED-ARRAY-SMD_4P-L1.0-W1.0-TR-RD]
LED415  FC-B1010RGBT-HG  [LED-ARRAY-SMD_4P-L1.0-W1.0-TR-RD]
LED416  FC-B1010RGBT-HG  [LED-ARRAY-SMD_4P-L1.0-W1.0-TR-RD]
LED417  FC-B1010RGBT-HG  [LED-ARRAY-SMD_4P-L1.0-W1.0-TR-RD]
LED418  FC-B1010RGBT-HG  [LED-ARRAY-SMD_4P-L1.0-W1.0-TR-RD]
LED419  FC-B1010RGBT-HG  [LED-ARRAY-SMD_4P-L1.0-W1.0-TR-RD]
LED420  FC-B1010RGBT-HG  [LED-ARRAY-SMD_4P-L1.0-W1.0-TR-RD]
LED421  FC-B1010RGBT-HG  [LED-ARRAY-SMD_4P-L1.0-W1.0-TR-RD]
LED422  FC-B1010RGBT-HG  [LED-ARRAY-SMD_4P-L1.0-W1.0-TR-RD]
LED423  FC-B1010RGBT-HG  [LED-ARRAY-SMD_4P-L1.0-W1.0-TR-RD]
LED424  FC-B1010RGBT-HG  [LED-ARRAY-SMD_4P-L1.0-W1.0-TR-RD]
LED425  FC-B1010RGBT-HG  [LED-ARRAY-SMD_4P-L1.0-W1.0-TR-RD]
LED426  FC-B1010RGBT-HG  [LED-ARRAY-SMD_4P-L1.0-W1.0-TR-RD]
LED427  FC-B1010RGBT-HG  [LED-ARRAY-SMD_4P-L1.0-W1.0-TR-RD]
LED428  FC-B1010RGBT-HG  [LED-ARRAY-SMD_4P-L1.0-W1.0-TR-RD]
LED429  FC-B1010RGBT-HG  [LED-ARRAY-SMD_4P-L1.0-W1.0-TR-RD]
LED430  FC-B1010RGBT-HG  [LED-ARRAY-SMD_4P-L1.0-W1.0-TR-RD]
LED431  FC-B1010RGBT-HG  [LED-ARRAY-SMD_4P-L1.0-W1.0-TR-RD]
LED432  FC-B1010RGBT-HG  [LED-ARRAY-SMD_4P-L1.0-W1.0-TR-RD]
LED433  FC-B1010RGBT-HG  [LED-ARRAY-SMD_4P-L1.0-W1.0-TR-RD]
LED434  FC-B1010RGBT-HG  [LED-ARRAY-SMD_4P-L1.0-W1.0-TR-RD]
LED435  FC-B1010RGBT-HG  [LED-ARRAY-SMD_4P-L1.0-W1.0-TR-RD]
LED436  FC-B1010RGBT-HG  [LED-ARRAY-SMD_4P-L1.0-W1.0-TR-RD]
LED437  FC-B1010RGBT-HG  [LED-ARRAY-SMD_4P-L1.0-W1.0-TR-RD]
LED438  FC-B1010RGBT-HG  [LED-ARRAY-SMD_4P-L1.0-W1.0-TR-RD]
LED439  FC-B1010RGBT-HG  [LED-ARRAY-SMD_4P-L1.0-W1.0-TR-RD]
LED440  FC-B1010RGBT-HG  [LED-ARRAY-SMD_4P-L1.0-W1.0-TR-RD]
LED441  FC-B1010RGBT-HG  [LED-ARRAY-SMD_4P-L1.0-W1.0-TR-RD]
LED442  FC-B1010RGBT-HG  [LED-ARRAY-SMD_4P-L1.0-W1.0-TR-RD]
LED443  FC-B1010RGBT-HG  [LED-ARRAY-SMD_4P-L1.0-W1.0-TR-RD]
LED444  FC-B1010RGBT-HG  [LED-ARRAY-SMD_4P-L1.0-W1.0-TR-RD]
LED445  FC-B1010RGBT-HG  [LED-ARRAY-SMD_4P-L1.0-W1.0-TR-RD]
LED446  FC-B1010RGBT-HG  [LED-ARRAY-SMD_4P-L1.0-W1.0-TR-RD]
LED447  FC-B1010RGBT-HG  [LED-ARRAY-SMD_4P-L1.0-W1.0-TR-RD]
LED448  FC-B1010RGBT-HG  [LED-ARRAY-SMD_4P-L1.0-W1.0-TR-RD]
LED449  FC-B1010RGBT-HG  [LED-ARRAY-SMD_4P-L1.0-W1.0-TR-RD]
LED450  FC-B1010RGBT-HG  [LED-ARRAY-SMD_4P-L1.0-W1.0-TR-RD]
LED451  FC-B1010RGBT-HG  [LED-ARRAY-SMD_4P-L1.0-W1.0-TR-RD]
LED452  FC-B1010RGBT-HG  [LED-ARRAY-SMD_4P-L1.0-W1.0-TR-RD]
LED453  FC-B1010RGBT-HG  [LED-ARRAY-SMD_4P-L1.0-W1.0-TR-RD]
LED454  FC-B1010RGBT-HG  [LED-ARRAY-SMD_4P-L1.0-W1.0-TR-RD]
LED455  FC-B1010RGBT-HG  [LED-ARRAY-SMD_4P-L1.0-W1.0-TR-RD]
LED456  FC-B1010RGBT-HG  [LED-ARRAY-SMD_4P-L1.0-W1.0-TR-RD]
LED457  FC-B1010RGBT-HG  [LED-ARRAY-SMD_4P-L1.0-W1.0-TR-RD]
LED458  FC-B1010RGBT-HG  [LED-ARRAY-SMD_4P-L1.0-W1.0-TR-RD]
LED459  FC-B1010RGBT-HG  [LED-ARRAY-SMD_4P-L1.0-W1.0-TR-RD]
LED460  FC-B1010RGBT-HG  [LED-ARRAY-SMD_4P-L1.0-W1.0-TR-RD]
LED461  FC-B1010RGBT-HG  [LED-ARRAY-SMD_4P-L1.0-W1.0-TR-RD]
LED462  FC-B1010RGBT-HG  [LED-ARRAY-SMD_4P-L1.0-W1.0-TR-RD]
LED463  FC-B1010RGBT-HG  [LED-ARRAY-SMD_4P-L1.0-W1.0-TR-RD]
LED464  FC-B1010RGBT-HG  [LED-ARRAY-SMD_4P-L1.0-W1.0-TR-RD]
LED465  FC-B1010RGBT-HG  [LED-ARRAY-SMD_4P-L1.0-W1.0-TR-RD]
LED466  FC-B1010RGBT-HG  [LED-ARRAY-SMD_4P-L1.0-W1.0-TR-RD]
LED467  FC-B1010RGBT-HG  [LED-ARRAY-SMD_4P-L1.0-W1.0-TR-RD]
LED468  FC-B1010RGBT-HG  [LED-ARRAY-SMD_4P-L1.0-W1.0-TR-RD]
LED469  FC-B1010RGBT-HG  [LED-ARRAY-SMD_4P-L1.0-W1.0-TR-RD]
LED470  FC-B1010RGBT-HG  [LED-ARRAY-SMD_4P-L1.0-W1.0-TR-RD]
LED471  FC-B1010RGBT-HG  [LED-ARRAY-SMD_4P-L1.0-W1.0-TR-RD]
LED472  FC-B1010RGBT-HG  [LED-ARRAY-SMD_4P-L1.0-W1.0-TR-RD]
LED473  FC-B1010RGBT-HG  [LED-ARRAY-SMD_4P-L1.0-W1.0-TR-RD]
LED474  FC-B1010RGBT-HG  [LED-ARRAY-SMD_4P-L1.0-W1.0-TR-RD]
LED475  FC-B1010RGBT-HG  [LED-ARRAY-SMD_4P-L1.0-W1.0-TR-RD]
LED476  FC-B1010RGBT-HG  [LED-ARRAY-SMD_4P-L1.0-W1.0-TR-RD]
LED477  FC-B1010RGBT-HG  [LED-ARRAY-SMD_4P-L1.0-W1.0-TR-RD]
LED478  FC-B1010RGBT-HG  [LED-ARRAY-SMD_4P-L1.0-W1.0-TR-RD]
LED479  FC-B1010RGBT-HG  [LED-ARRAY-SMD_4P-L1.0-W1.0-TR-RD]
LED480  FC-B1010RGBT-HG  [LED-ARRAY-SMD_4P-L1.0-W1.0-TR-RD]

## Library data of the parts
LED1-LED480 = FC-B1010RGBT-HG: Emitted Color:RGB; LCSC Part Name: RGB三色; Supplier Part: C158099; Manufacturer: 国星光电; Supplier Footprint: 0404; JLCPCB Part Class: Extended Part; Datasheet: https://atta.szlcsc.com/upload/public/pdf/source/20200910/C158099_0C805F16310A4C6DB0163E8F613FF382.pdf; Supplier: LCSC; Emitted Color: RGB

## Nets
B0: LED1.2(-) LED2.2(-) LED3.2(-) LED4.2(-) LED5.2(-) LED6.2(-) LED7.2(-) LED8.2(-) LED9.2(-) LED10.2(-) LED11.2(-) LED12.2(-) LED13.2(-) LED14.2(-) LED15.2(-) LED16.2(-) LED17.2(-) LED18.2(-) LED19.2(-) LED20.2(-) LED21.2(-) LED22.2(-) LED23.2(-) LED24.2(-) LED25.2(-) LED26.2(-) LED27.2(-) LED28.2(-) LED29.2(-) LED30.2(-) LED31.2(-) LED32.2(-) LED33.2(-) LED34.2(-) LED35.2(-) LED36.2(-) LED37.2(-) LED38.2(-) LED39.2(-) LED40.2(-) LED41.2(-) LED42.2(-) LED43.2(-) LED44.2(-) LED45.2(-) LED46.2(-) LED47.2(-) LED48.2(-)
B1: LED49.2(-) LED50.2(-) LED51.2(-) LED52.2(-) LED53.2(-) LED54.2(-) LED55.2(-) LED56.2(-) LED57.2(-) LED58.2(-) LED59.2(-) LED60.2(-) LED61.2(-) LED62.2(-) LED63.2(-) LED64.2(-) LED65.2(-) LED66.2(-) LED67.2(-) LED68.2(-) LED69.2(-) LED70.2(-) LED71.2(-) LED72.2(-) LED73.2(-) LED74.2(-) LED75.2(-) LED76.2(-) LED77.2(-) LED78.2(-) LED79.2(-) LED80.2(-) LED81.2(-) LED82.2(-) LED83.2(-) LED84.2(-) LED85.2(-) LED86.2(-) LED87.2(-) LED88.2(-) LED89.2(-) LED90.2(-) LED91.2(-) LED92.2(-) LED93.2(-) LED94.2(-) LED95.2(-) LED96.2(-)
B2: LED97.2(-) LED98.2(-) LED99.2(-) LED100.2(-) LED101.2(-) LED102.2(-) LED103.2(-) LED104.2(-) LED105.2(-) LED106.2(-) LED107.2(-) LED108.2(-) LED109.2(-) LED110.2(-) LED111.2(-) LED112.2(-) LED113.2(-) LED114.2(-) LED115.2(-) LED116.2(-) LED117.2(-) LED118.2(-) LED119.2(-) LED120.2(-) LED121.2(-) LED122.2(-) LED123.2(-) LED124.2(-) LED125.2(-) LED126.2(-) LED127.2(-) LED128.2(-) LED129.2(-) LED130.2(-) LED131.2(-) LED132.2(-) LED133.2(-) LED134.2(-) LED135.2(-) LED136.2(-) LED137.2(-) LED138.2(-) LED139.2(-) LED140.2(-) LED141.2(-) LED142.2(-) LED143.2(-) LED144.2(-)
B3: LED145.2(-) LED146.2(-) LED147.2(-) LED148.2(-) LED149.2(-) LED150.2(-) LED151.2(-) LED152.2(-) LED153.2(-) LED154.2(-) LED155.2(-) LED156.2(-) LED157.2(-) LED158.2(-) LED159.2(-) LED160.2(-) LED161.2(-) LED162.2(-) LED163.2(-) LED164.2(-) LED165.2(-) LED166.2(-) LED167.2(-) LED168.2(-) LED169.2(-) LED170.2(-) LED171.2(-) LED172.2(-) LED173.2(-) LED174.2(-) LED175.2(-) LED176.2(-) LED177.2(-) LED178.2(-) LED179.2(-) LED180.2(-) LED181.2(-) LED182.2(-) LED183.2(-) LED184.2(-) LED185.2(-) LED186.2(-) LED187.2(-) LED188.2(-) LED189.2(-) LED190.2(-) LED191.2(-) LED192.2(-)
B4: LED193.2(-) LED194.2(-) LED195.2(-) LED196.2(-) LED197.2(-) LED198.2(-) LED199.2(-) LED200.2(-) LED201.2(-) LED202.2(-) LED203.2(-) LED204.2(-) LED205.2(-) LED206.2(-) LED207.2(-) LED208.2(-) LED209.2(-) LED210.2(-) LED211.2(-) LED212.2(-) LED213.2(-) LED214.2(-) LED215.2(-) LED216.2(-) LED217.2(-) LED218.2(-) LED219.2(-) LED220.2(-) LED221.2(-) LED222.2(-) LED223.2(-) LED224.2(-) LED225.2(-) LED226.2(-) LED227.2(-) LED228.2(-) LED229.2(-) LED230.2(-) LED231.2(-) LED232.2(-) LED233.2(-) LED234.2(-) LED235.2(-) LED236.2(-) LED237.2(-) LED238.2(-) LED239.2(-) LED240.2(-)
B5: LED241.2(-) LED242.2(-) LED243.2(-) LED244.2(-) LED245.2(-) LED246.2(-) LED247.2(-) LED248.2(-) LED249.2(-) LED250.2(-) LED251.2(-) LED252.2(-) LED253.2(-) LED254.2(-) LED255.2(-) LED256.2(-) LED257.2(-) LED258.2(-) LED259.2(-) LED260.2(-) LED261.2(-) LED262.2(-) LED263.2(-) LED264.2(-) LED265.2(-) LED266.2(-) LED267.2(-) LED268.2(-) LED269.2(-) LED270.2(-) LED271.2(-) LED272.2(-) LED273.2(-) LED274.2(-) LED275.2(-) LED276.2(-) LED277.2(-) LED278.2(-) LED279.2(-) LED280.2(-) LED281.2(-) LED282.2(-) LED283.2(-) LED284.2(-) LED285.2(-) LED286.2(-) LED287.2(-) LED288.2(-)
B6: LED289.2(-) LED290.2(-) LED291.2(-) LED292.2(-) LED293.2(-) LED294.2(-) LED295.2(-) LED296.2(-) LED297.2(-) LED298.2(-) LED299.2(-) LED300.2(-) LED301.2(-) LED302.2(-) LED303.2(-) LED304.2(-) LED305.2(-) LED306.2(-) LED307.2(-) LED308.2(-) LED309.2(-) LED310.2(-) LED311.2(-) LED312.2(-) LED313.2(-) LED314.2(-) LED315.2(-) LED316.2(-) LED317.2(-) LED318.2(-) LED319.2(-) LED320.2(-) LED321.2(-) LED322.2(-) LED323.2(-) LED324.2(-) LED325.2(-) LED326.2(-) LED327.2(-) LED328.2(-) LED329.2(-) LED330.2(-) LED331.2(-) LED332.2(-) LED333.2(-) LED334.2(-) LED335.2(-) LED336.2(-)
B7: LED337.2(-) LED338.2(-) LED339.2(-) LED340.2(-) LED341.2(-) LED342.2(-) LED343.2(-) LED344.2(-) LED345.2(-) LED346.2(-) LED347.2(-) LED348.2(-) LED349.2(-) LED350.2(-) LED351.2(-) LED352.2(-) LED353.2(-) LED354.2(-) LED355.2(-) LED356.2(-) LED357.2(-) LED358.2(-) LED359.2(-) LED360.2(-) LED361.2(-) LED362.2(-) LED363.2(-) LED364.2(-) LED365.2(-) LED366.2(-) LED367.2(-) LED368.2(-) LED369.2(-) LED370.2(-) LED371.2(-) LED372.2(-) LED373.2(-) LED374.2(-) LED375.2(-) LED376.2(-) LED377.2(-) LED378.2(-) LED379.2(-) LED380.2(-) LED381.2(-) LED382.2(-) LED383.2(-) LED384.2(-)
B8: LED385.2(-) LED386.2(-) LED387.2(-) LED388.2(-) LED389.2(-) LED390.2(-) LED391.2(-) LED392.2(-) LED393.2(-) LED394.2(-) LED395.2(-) LED396.2(-) LED397.2(-) LED398.2(-) LED399.2(-) LED400.2(-) LED401.2(-) LED402.2(-) LED403.2(-) LED404.2(-) LED405.2(-) LED406.2(-) LED407.2(-) LED408.2(-) LED409.2(-) LED410.2(-) LED411.2(-) LED412.2(-) LED413.2(-) LED414.2(-) LED415.2(-) LED416.2(-) LED417.2(-) LED418.2(-) LED419.2(-) LED420.2(-) LED421.2(-) LED422.2(-) LED423.2(-) LED424.2(-) LED425.2(-) LED426.2(-) LED427.2(-) LED428.2(-) LED429.2(-) LED430.2(-) LED431.2(-) LED432.2(-)
B9: LED433.2(-) LED434.2(-) LED435.2(-) LED436.2(-) LED437.2(-) LED438.2(-) LED439.2(-) LED440.2(-) LED441.2(-) LED442.2(-) LED443.2(-) LED444.2(-) LED445.2(-) LED446.2(-) LED447.2(-) LED448.2(-) LED449.2(-) LED450.2(-) LED451.2(-) LED452.2(-) LED453.2(-) LED454.2(-) LED455.2(-) LED456.2(-) LED457.2(-) LED458.2(-) LED459.2(-) LED460.2(-) LED461.2(-) LED462.2(-) LED463.2(-) LED464.2(-) LED465.2(-) LED466.2(-) LED467.2(-) LED468.2(-) LED469.2(-) LED470.2(-) LED471.2(-) LED472.2(-) LED473.2(-) LED474.2(-) LED475.2(-) LED476.2(-) LED477.2(-) LED478.2(-) LED479.2(-) LED480.2(-)
G0: LED1.3(-) LED2.3(-) LED3.3(-) LED4.3(-) LED5.3(-) LED6.3(-) LED7.3(-) LED8.3(-) LED9.3(-) LED10.3(-) LED11.3(-) LED12.3(-) LED13.3(-) LED14.3(-) LED15.3(-) LED16.3(-) LED17.3(-) LED18.3(-) LED19.3(-) LED20.3(-) LED21.3(-) LED22.3(-) LED23.3(-) LED24.3(-) LED25.3(-) LED26.3(-) LED27.3(-) LED28.3(-) LED29.3(-) LED30.3(-) LED31.3(-) LED32.3(-) LED33.3(-) LED34.3(-) LED35.3(-) LED36.3(-) LED37.3(-) LED38.3(-) LED39.3(-) LED40.3(-) LED41.3(-) LED42.3(-) LED43.3(-) LED44.3(-) LED45.3(-) LED46.3(-) LED47.3(-) LED48.3(-)
G1: LED49.3(-) LED50.3(-) LED51.3(-) LED52.3(-) LED53.3(-) LED54.3(-) LED55.3(-) LED56.3(-) LED57.3(-) LED58.3(-) LED59.3(-) LED60.3(-) LED61.3(-) LED62.3(-) LED63.3(-) LED64.3(-) LED65.3(-) LED66.3(-) LED67.3(-) LED68.3(-) LED69.3(-) LED70.3(-) LED71.3(-) LED72.3(-) LED73.3(-) LED74.3(-) LED75.3(-) LED76.3(-) LED77.3(-) LED78.3(-) LED79.3(-) LED80.3(-) LED81.3(-) LED82.3(-) LED83.3(-) LED84.3(-) LED85.3(-) LED86.3(-) LED87.3(-) LED88.3(-) LED89.3(-) LED90.3(-) LED91.3(-) LED92.3(-) LED93.3(-) LED94.3(-) LED95.3(-) LED96.3(-)
G2: LED97.3(-) LED98.3(-) LED99.3(-) LED100.3(-) LED101.3(-) LED102.3(-) LED103.3(-) LED104.3(-) LED105.3(-) LED106.3(-) LED107.3(-) LED108.3(-) LED109.3(-) LED110.3(-) LED111.3(-) LED112.3(-) LED113.3(-) LED114.3(-) LED115.3(-) LED116.3(-) LED117.3(-) LED118.3(-) LED119.3(-) LED120.3(-) LED121.3(-) LED122.3(-) LED123.3(-) LED124.3(-) LED125.3(-) LED126.3(-) LED127.3(-) LED128.3(-) LED129.3(-) LED130.3(-) LED131.3(-) LED132.3(-) LED133.3(-) LED134.3(-) LED135.3(-) LED136.3(-) LED137.3(-) LED138.3(-) LED139.3(-) LED140.3(-) LED141.3(-) LED142.3(-) LED143.3(-) LED144.3(-)
G3: LED145.3(-) LED146.3(-) LED147.3(-) LED148.3(-) LED149.3(-) LED150.3(-) LED151.3(-) LED152.3(-) LED153.3(-) LED154.3(-) LED155.3(-) LED156.3(-) LED157.3(-) LED158.3(-) LED159.3(-) LED160.3(-) LED161.3(-) LED162.3(-) LED163.3(-) LED164.3(-) LED165.3(-) LED166.3(-) LED167.3(-) LED168.3(-) LED169.3(-) LED170.3(-) LED171.3(-) LED172.3(-) LED173.3(-) LED174.3(-) LED175.3(-) LED176.3(-) LED177.3(-) LED178.3(-) LED179.3(-) LED180.3(-) LED181.3(-) LED182.3(-) LED183.3(-) LED184.3(-) LED185.3(-) LED186.3(-) LED187.3(-) LED188.3(-) LED189.3(-) LED190.3(-) LED191.3(-) LED192.3(-)
G4: LED193.3(-) LED194.3(-) LED195.3(-) LED196.3(-) LED197.3(-) LED198.3(-) LED199.3(-) LED200.3(-) LED201.3(-) LED202.3(-) LED203.3(-) LED204.3(-) LED205.3(-) LED206.3(-) LED207.3(-) LED208.3(-) LED209.3(-) LED210.3(-) LED211.3(-) LED212.3(-) LED213.3(-) LED214.3(-) LED215.3(-) LED216.3(-) LED217.3(-) LED218.3(-) LED219.3(-) LED220.3(-) LED221.3(-) LED222.3(-) LED223.3(-) LED224.3(-) LED225.3(-) LED226.3(-) LED227.3(-) LED228.3(-) LED229.3(-) LED230.3(-) LED231.3(-) LED232.3(-) LED233.3(-) LED234.3(-) LED235.3(-) LED236.3(-) LED237.3(-) LED238.3(-) LED239.3(-) LED240.3(-)
G5: LED241.3(-) LED242.3(-) LED243.3(-) LED244.3(-) LED245.3(-) LED246.3(-) LED247.3(-) LED248.3(-) LED249.3(-) LED250.3(-) LED251.3(-) LED252.3(-) LED253.3(-) LED254.3(-) LED255.3(-) LED256.3(-) LED257.3(-) LED258.3(-) LED259.3(-) LED260.3(-) LED261.3(-) LED262.3(-) LED263.3(-) LED264.3(-) LED265.3(-) LED266.3(-) LED267.3(-) LED268.3(-) LED269.3(-) LED270.3(-) LED271.3(-) LED272.3(-) LED273.3(-) LED274.3(-) LED275.3(-) LED276.3(-) LED277.3(-) LED278.3(-) LED279.3(-) LED280.3(-) LED281.3(-) LED282.3(-) LED283.3(-) LED284.3(-) LED285.3(-) LED286.3(-) LED287.3(-) LED288.3(-)
G6: LED289.3(-) LED290.3(-) LED291.3(-) LED292.3(-) LED293.3(-) LED294.3(-) LED295.3(-) LED296.3(-) LED297.3(-) LED298.3(-) LED299.3(-) LED300.3(-) LED301.3(-) LED302.3(-) LED303.3(-) LED304.3(-) LED305.3(-) LED306.3(-) LED307.3(-) LED308.3(-) LED309.3(-) LED310.3(-) LED311.3(-) LED312.3(-) LED313.3(-) LED314.3(-) LED315.3(-) LED316.3(-) LED317.3(-) LED318.3(-) LED319.3(-) LED320.3(-) LED321.3(-) LED322.3(-) LED323.3(-) LED324.3(-) LED325.3(-) LED326.3(-) LED327.3(-) LED328.3(-) LED329.3(-) LED330.3(-) LED331.3(-) LED332.3(-) LED333.3(-) LED334.3(-) LED335.3(-) LED336.3(-)
G7: LED337.3(-) LED338.3(-) LED339.3(-) LED340.3(-) LED341.3(-) LED342.3(-) LED343.3(-) LED344.3(-) LED345.3(-) LED346.3(-) LED347.3(-) LED348.3(-) LED349.3(-) LED350.3(-) LED351.3(-) LED352.3(-) LED353.3(-) LED354.3(-) LED355.3(-) LED356.3(-) LED357.3(-) LED358.3(-) LED359.3(-) LED360.3(-) LED361.3(-) LED362.3(-) LED363.3(-) LED364.3(-) LED365.3(-) LED366.3(-) LED367.3(-) LED368.3(-) LED369.3(-) LED370.3(-) LED371.3(-) LED372.3(-) LED373.3(-) LED374.3(-) LED375.3(-) LED376.3(-) LED377.3(-) LED378.3(-) LED379.3(-) LED380.3(-) LED381.3(-) LED382.3(-) LED383.3(-) LED384.3(-)
G8: LED385.3(-) LED386.3(-) LED387.3(-) LED388.3(-) LED389.3(-) LED390.3(-) LED391.3(-) LED392.3(-) LED393.3(-) LED394.3(-) LED395.3(-) LED396.3(-) LED397.3(-) LED398.3(-) LED399.3(-) LED400.3(-) LED401.3(-) LED402.3(-) LED403.3(-) LED404.3(-) LED405.3(-) LED406.3(-) LED407.3(-) LED408.3(-) LED409.3(-) LED410.3(-) LED411.3(-) LED412.3(-) LED413.3(-) LED414.3(-) LED415.3(-) LED416.3(-) LED417.3(-) LED418.3(-) LED419.3(-) LED420.3(-) LED421.3(-) LED422.3(-) LED423.3(-) LED424.3(-) LED425.3(-) LED426.3(-) LED427.3(-) LED428.3(-) LED429.3(-) LED430.3(-) LED431.3(-) LED432.3(-)
G9: LED433.3(-) LED434.3(-) LED435.3(-) LED436.3(-) LED437.3(-) LED438.3(-) LED439.3(-) LED440.3(-) LED441.3(-) LED442.3(-) LED443.3(-) LED444.3(-) LED445.3(-) LED446.3(-) LED447.3(-) LED448.3(-) LED449.3(-) LED450.3(-) LED451.3(-) LED452.3(-) LED453.3(-) LED454.3(-) LED455.3(-) LED456.3(-) LED457.3(-) LED458.3(-) LED459.3(-) LED460.3(-) LED461.3(-) LED462.3(-) LED463.3(-) LED464.3(-) LED465.3(-) LED466.3(-) LED467.3(-) LED468.3(-) LED469.3(-) LED470.3(-) LED471.3(-) LED472.3(-) LED473.3(-) LED474.3(-) LED475.3(-) LED476.3(-) LED477.3(-) LED478.3(-) LED479.3(-) LED480.3(-)
PWR0: LED1.1(+) LED49.1(+) LED97.1(+) LED145.1(+) LED193.1(+) LED241.1(+) LED289.1(+) LED337.1(+) LED385.1(+) LED433.1(+)
PWR1: LED2.1(+) LED50.1(+) LED98.1(+) LED146.1(+) LED194.1(+) LED242.1(+) LED290.1(+) LED338.1(+) LED386.1(+) LED434.1(+)
PWR2: LED3.1(+) LED51.1(+) LED99.1(+) LED147.1(+) LED195.1(+) LED243.1(+) LED291.1(+) LED339.1(+) LED387.1(+) LED435.1(+)
PWR3: LED4.1(+) LED52.1(+) LED100.1(+) LED148.1(+) LED196.1(+) LED244.1(+) LED292.1(+) LED340.1(+) LED388.1(+) LED436.1(+)
PWR4: LED5.1(+) LED53.1(+) LED101.1(+) LED149.1(+) LED197.1(+) LED245.1(+) LED293.1(+) LED341.1(+) LED389.1(+) LED437.1(+)
PWR5: LED6.1(+) LED54.1(+) LED102.1(+) LED150.1(+) LED198.1(+) LED246.1(+) LED294.1(+) LED342.1(+) LED390.1(+) LED438.1(+)
PWR6: LED7.1(+) LED55.1(+) LED103.1(+) LED151.1(+) LED199.1(+) LED247.1(+) LED295.1(+) LED343.1(+) LED391.1(+) LED439.1(+)
PWR7: LED8.1(+) LED56.1(+) LED104.1(+) LED152.1(+) LED200.1(+) LED248.1(+) LED296.1(+) LED344.1(+) LED392.1(+) LED440.1(+)
PWR8: LED9.1(+) LED57.1(+) LED105.1(+) LED153.1(+) LED201.1(+) LED249.1(+) LED297.1(+) LED345.1(+) LED393.1(+) LED441.1(+)
PWR9: LED10.1(+) LED58.1(+) LED106.1(+) LED154.1(+) LED202.1(+) LED250.1(+) LED298.1(+) LED346.1(+) LED394.1(+) LED442.1(+)
PWR10: LED11.1(+) LED59.1(+) LED107.1(+) LED155.1(+) LED203.1(+) LED251.1(+) LED299.1(+) LED347.1(+) LED395.1(+) LED443.1(+)
PWR11: LED12.1(+) LED60.1(+) LED108.1(+) LED156.1(+) LED204.1(+) LED252.1(+) LED300.1(+) LED348.1(+) LED396.1(+) LED444.1(+)
PWR12: LED13.1(+) LED61.1(+) LED109.1(+) LED157.1(+) LED205.1(+) LED253.1(+) LED301.1(+) LED349.1(+) LED397.1(+) LED445.1(+)
PWR13: LED14.1(+) LED62.1(+) LED110.1(+) LED158.1(+) LED206.1(+) LED254.1(+) LED302.1(+) LED350.1(+) LED398.1(+) LED446.1(+)
PWR14: LED15.1(+) LED63.1(+) LED111.1(+) LED159.1(+) LED207.1(+) LED255.1(+) LED303.1(+) LED351.1(+) LED399.1(+) LED447.1(+)
PWR15: LED16.1(+) LED64.1(+) LED112.1(+) LED160.1(+) LED208.1(+) LED256.1(+) LED304.1(+) LED352.1(+) LED400.1(+) LED448.1(+)
PWR16: LED17.1(+) LED65.1(+) LED113.1(+) LED161.1(+) LED209.1(+) LED257.1(+) LED305.1(+) LED353.1(+) LED401.1(+) LED449.1(+)
PWR17: LED18.1(+) LED66.1(+) LED114.1(+) LED162.1(+) LED210.1(+) LED258.1(+) LED306.1(+) LED354.1(+) LED402.1(+) LED450.1(+)
PWR18: LED19.1(+) LED67.1(+) LED115.1(+) LED163.1(+) LED211.1(+) LED259.1(+) LED307.1(+) LED355.1(+) LED403.1(+) LED451.1(+)
PWR19: LED20.1(+) LED68.1(+) LED116.1(+) LED164.1(+) LED212.1(+) LED260.1(+) LED308.1(+) LED356.1(+) LED404.1(+) LED452.1(+)
PWR20: LED21.1(+) LED69.1(+) LED117.1(+) LED165.1(+) LED213.1(+) LED261.1(+) LED309.1(+) LED357.1(+) LED405.1(+) LED453.1(+)
PWR21: LED22.1(+) LED70.1(+) LED118.1(+) LED166.1(+) LED214.1(+) LED262.1(+) LED310.1(+) LED358.1(+) LED406.1(+) LED454.1(+)
PWR22: LED23.1(+) LED71.1(+) LED119.1(+) LED167.1(+) LED215.1(+) LED263.1(+) LED311.1(+) LED359.1(+) LED407.1(+) LED455.1(+)
PWR23: LED24.1(+) LED72.1(+) LED120.1(+) LED168.1(+) LED216.1(+) LED264.1(+) LED312.1(+) LED360.1(+) LED408.1(+) LED456.1(+)
PWR24: LED25.1(+) LED73.1(+) LED121.1(+) LED169.1(+) LED217.1(+) LED265.1(+) LED313.1(+) LED361.1(+) LED409.1(+) LED457.1(+)
PWR25: LED26.1(+) LED74.1(+) LED122.1(+) LED170.1(+) LED218.1(+) LED266.1(+) LED314.1(+) LED362.1(+) LED410.1(+) LED458.1(+)
PWR26: LED27.1(+) LED75.1(+) LED123.1(+) LED171.1(+) LED219.1(+) LED267.1(+) LED315.1(+) LED363.1(+) LED411.1(+) LED459.1(+)
PWR27: LED28.1(+) LED76.1(+) LED124.1(+) LED172.1(+) LED220.1(+) LED268.1(+) LED316.1(+) LED364.1(+) LED412.1(+) LED460.1(+)
PWR28: LED29.1(+) LED77.1(+) LED125.1(+) LED173.1(+) LED221.1(+) LED269.1(+) LED317.1(+) LED365.1(+) LED413.1(+) LED461.1(+)
PWR29: LED30.1(+) LED78.1(+) LED126.1(+) LED174.1(+) LED222.1(+) LED270.1(+) LED318.1(+) LED366.1(+) LED414.1(+) LED462.1(+)
PWR30: LED31.1(+) LED79.1(+) LED127.1(+) LED175.1(+) LED223.1(+) LED271.1(+) LED319.1(+) LED367.1(+) LED415.1(+) LED463.1(+)
PWR31: LED32.1(+) LED80.1(+) LED128.1(+) LED176.1(+) LED224.1(+) LED272.1(+) LED320.1(+) LED368.1(+) LED416.1(+) LED464.1(+)
PWR32: LED33.1(+) LED81.1(+) LED129.1(+) LED177.1(+) LED225.1(+) LED273.1(+) LED321.1(+) LED369.1(+) LED417.1(+) LED465.1(+)
PWR33: LED34.1(+) LED82.1(+) LED130.1(+) LED178.1(+) LED226.1(+) LED274.1(+) LED322.1(+) LED370.1(+) LED418.1(+) LED466.1(+)
PWR34: LED35.1(+) LED83.1(+) LED131.1(+) LED179.1(+) LED227.1(+) LED275.1(+) LED323.1(+) LED371.1(+) LED419.1(+) LED467.1(+)
PWR35: LED36.1(+) LED84.1(+) LED132.1(+) LED180.1(+) LED228.1(+) LED276.1(+) LED324.1(+) LED372.1(+) LED420.1(+) LED468.1(+)
PWR36: LED37.1(+) LED85.1(+) LED133.1(+) LED181.1(+) LED229.1(+) LED277.1(+) LED325.1(+) LED373.1(+) LED421.1(+) LED469.1(+)
PWR37: LED38.1(+) LED86.1(+) LED134.1(+) LED182.1(+) LED230.1(+) LED278.1(+) LED326.1(+) LED374.1(+) LED422.1(+) LED470.1(+)
PWR38: LED39.1(+) LED87.1(+) LED135.1(+) LED183.1(+) LED231.1(+) LED279.1(+) LED327.1(+) LED375.1(+) LED423.1(+) LED471.1(+)
PWR39: LED40.1(+) LED88.1(+) LED136.1(+) LED184.1(+) LED232.1(+) LED280.1(+) LED328.1(+) LED376.1(+) LED424.1(+) LED472.1(+)
PWR40: LED41.1(+) LED89.1(+) LED137.1(+) LED185.1(+) LED233.1(+) LED281.1(+) LED329.1(+) LED377.1(+) LED425.1(+) LED473.1(+)
PWR41: LED42.1(+) LED90.1(+) LED138.1(+) LED186.1(+) LED234.1(+) LED282.1(+) LED330.1(+) LED378.1(+) LED426.1(+) LED474.1(+)
PWR42: LED43.1(+) LED91.1(+) LED139.1(+) LED187.1(+) LED235.1(+) LED283.1(+) LED331.1(+) LED379.1(+) LED427.1(+) LED475.1(+)
PWR43: LED44.1(+) LED92.1(+) LED140.1(+) LED188.1(+) LED236.1(+) LED284.1(+) LED332.1(+) LED380.1(+) LED428.1(+) LED476.1(+)
PWR44: LED45.1(+) LED93.1(+) LED141.1(+) LED189.1(+) LED237.1(+) LED285.1(+) LED333.1(+) LED381.1(+) LED429.1(+) LED477.1(+)
PWR45: LED46.1(+) LED94.1(+) LED142.1(+) LED190.1(+) LED238.1(+) LED286.1(+) LED334.1(+) LED382.1(+) LED430.1(+) LED478.1(+)
PWR46: LED47.1(+) LED95.1(+) LED143.1(+) LED191.1(+) LED239.1(+) LED287.1(+) LED335.1(+) LED383.1(+) LED431.1(+) LED479.1(+)
PWR47: LED48.1(+) LED96.1(+) LED144.1(+) LED192.1(+) LED240.1(+) LED288.1(+) LED336.1(+) LED384.1(+) LED432.1(+) LED480.1(+)
R0: LED1.4(-) LED2.4(-) LED3.4(-) LED4.4(-) LED5.4(-) LED6.4(-) LED7.4(-) LED8.4(-) LED9.4(-) LED10.4(-) LED11.4(-) LED12.4(-) LED13.4(-) LED14.4(-) LED15.4(-) LED16.4(-) LED17.4(-) LED18.4(-) LED19.4(-) LED20.4(-) LED21.4(-) LED22.4(-) LED23.4(-) LED24.4(-) LED25.4(-) LED26.4(-) LED27.4(-) LED28.4(-) LED29.4(-) LED30.4(-) LED31.4(-) LED32.4(-) LED33.4(-) LED34.4(-) LED35.4(-) LED36.4(-) LED37.4(-) LED38.4(-) LED39.4(-) LED40.4(-) LED41.4(-) LED42.4(-) LED43.4(-) LED44.4(-) LED45.4(-) LED46.4(-) LED47.4(-) LED48.4(-)
R1: LED49.4(-) LED50.4(-) LED51.4(-) LED52.4(-) LED53.4(-) LED54.4(-) LED55.4(-) LED56.4(-) LED57.4(-) LED58.4(-) LED59.4(-) LED60.4(-) LED61.4(-) LED62.4(-) LED63.4(-) LED64.4(-) LED65.4(-) LED66.4(-) LED67.4(-) LED68.4(-) LED69.4(-) LED70.4(-) LED71.4(-) LED72.4(-) LED73.4(-) LED74.4(-) LED75.4(-) LED76.4(-) LED77.4(-) LED78.4(-) LED79.4(-) LED80.4(-) LED81.4(-) LED82.4(-) LED83.4(-) LED84.4(-) LED85.4(-) LED86.4(-) LED87.4(-) LED88.4(-) LED89.4(-) LED90.4(-) LED91.4(-) LED92.4(-) LED93.4(-) LED94.4(-) LED95.4(-) LED96.4(-)
R2: LED97.4(-) LED98.4(-) LED99.4(-) LED100.4(-) LED101.4(-) LED102.4(-) LED103.4(-) LED104.4(-) LED105.4(-) LED106.4(-) LED107.4(-) LED108.4(-) LED109.4(-) LED110.4(-) LED111.4(-) LED112.4(-) LED113.4(-) LED114.4(-) LED115.4(-) LED116.4(-) LED117.4(-) LED118.4(-) LED119.4(-) LED120.4(-) LED121.4(-) LED122.4(-) LED123.4(-) LED124.4(-) LED125.4(-) LED126.4(-) LED127.4(-) LED128.4(-) LED129.4(-) LED130.4(-) LED131.4(-) LED132.4(-) LED133.4(-) LED134.4(-) LED135.4(-) LED136.4(-) LED137.4(-) LED138.4(-) LED139.4(-) LED140.4(-) LED141.4(-) LED142.4(-) LED143.4(-) LED144.4(-)
R3: LED145.4(-) LED146.4(-) LED147.4(-) LED148.4(-) LED149.4(-) LED150.4(-) LED151.4(-) LED152.4(-) LED153.4(-) LED154.4(-) LED155.4(-) LED156.4(-) LED157.4(-) LED158.4(-) LED159.4(-) LED160.4(-) LED161.4(-) LED162.4(-) LED163.4(-) LED164.4(-) LED165.4(-) LED166.4(-) LED167.4(-) LED168.4(-) LED169.4(-) LED170.4(-) LED171.4(-) LED172.4(-) LED173.4(-) LED174.4(-) LED175.4(-) LED176.4(-) LED177.4(-) LED178.4(-) LED179.4(-) LED180.4(-) LED181.4(-) LED182.4(-) LED183.4(-) LED184.4(-) LED185.4(-) LED186.4(-) LED187.4(-) LED188.4(-) LED189.4(-) LED190.4(-) LED191.4(-) LED192.4(-)
R4: LED193.4(-) LED194.4(-) LED195.4(-) LED196.4(-) LED197.4(-) LED198.4(-) LED199.4(-) LED200.4(-) LED201.4(-) LED202.4(-) LED203.4(-) LED204.4(-) LED205.4(-) LED206.4(-) LED207.4(-) LED208.4(-) LED209.4(-) LED210.4(-) LED211.4(-) LED212.4(-) LED213.4(-) LED214.4(-) LED215.4(-) LED216.4(-) LED217.4(-) LED218.4(-) LED219.4(-) LED220.4(-) LED221.4(-) LED222.4(-) LED223.4(-) LED224.4(-) LED225.4(-) LED226.4(-) LED227.4(-) LED228.4(-) LED229.4(-) LED230.4(-) LED231.4(-) LED232.4(-) LED233.4(-) LED234.4(-) LED235.4(-) LED236.4(-) LED237.4(-) LED238.4(-) LED239.4(-) LED240.4(-)
